# EAGLE design v12 (EAGLE 9.3.0)

## Sheet 1 of 3
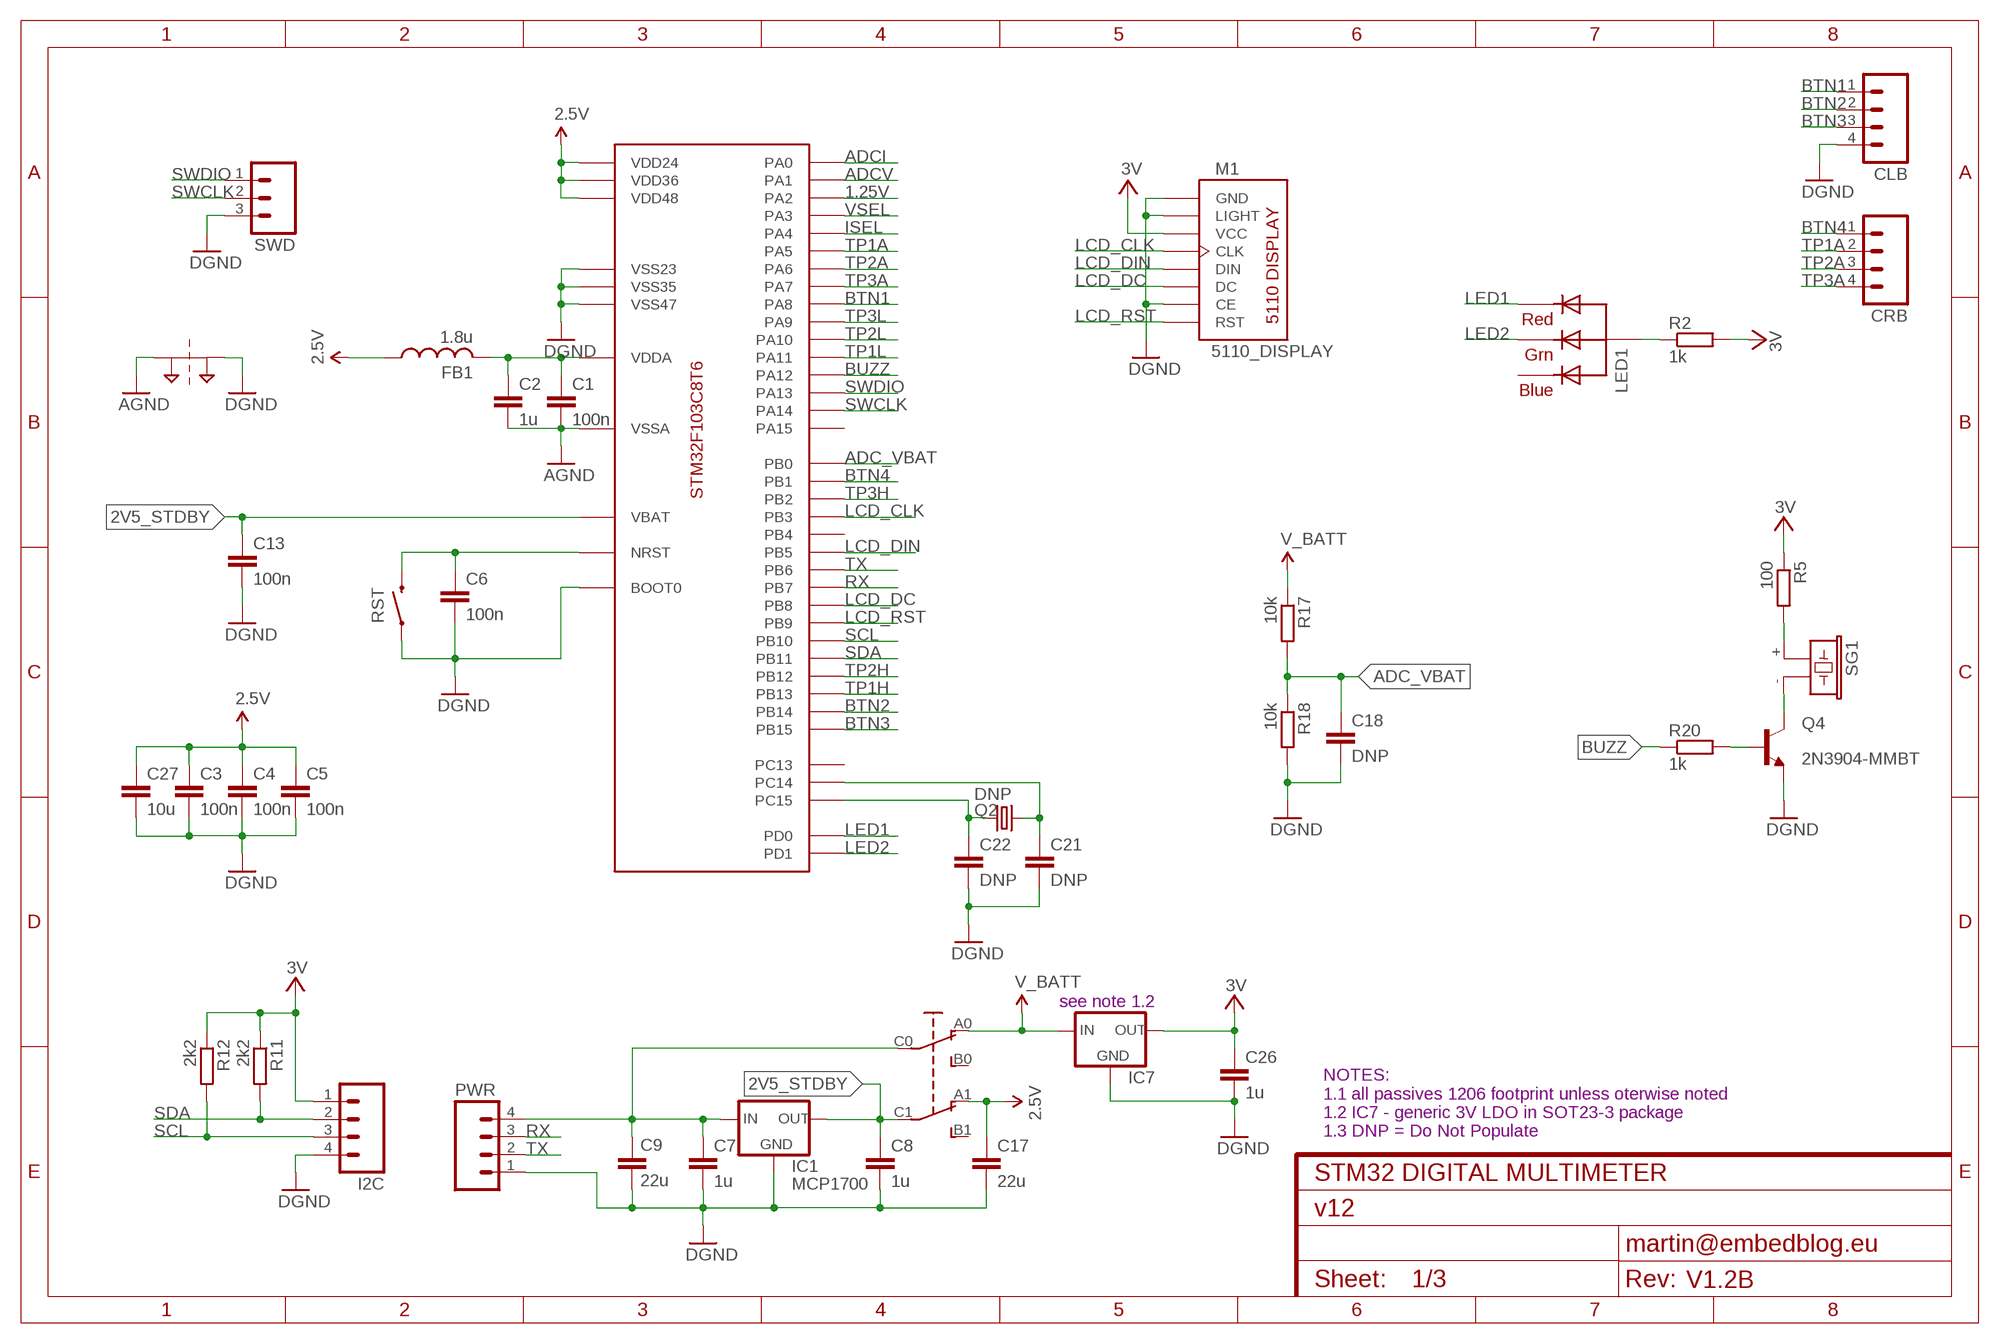
[diagram p0: schematic, sheet 1]
FRAME2 (FRAME-A4L): CNAME: STM32 DIGITAL MULTIMETER; CREVISION: V1.2B; DESIGNER: martin@embedblog.eu

### Parts
C1  100n  C-EUC1206  [C1206]
C2  1u  C-EUC1206  [C1206]
C3  100n  C-EUC1206  [C1206]
C4  100n  C-EUC1206  [C1206]
C5  100n  C-EUC1206  [C1206]
C6  100n  C-EUC1206  [C1206]
C7  1u  C-EUC1206  [C1206]
C8  1u  C-EUC1206  [C1206]
C9  22u  C-EUC1206  [C1206]
C13  100n  C-EUC1206  [C1206]
C17  22u  C-EUC1206  [C1206]
C18  DNP  C-EUC1206  [C1206]
C21  DNP  C-EUC1206  [C1206]
C22  DNP  C-EUC1206  [C1206]
C26  1u  C-EUC1206  [C1206]
C27  10u  C-EUC1206  [C1206]
CLB  M04PTH  [1X04@1]
CRB  M04PTH  [1X04@1]
FB1  1.8u  FERRITE-BEADC  [1206]
I2C  M04PTH  [1X04@1]
IC1  MCP1700  XC63FPM  [SOT23]
IC7  XC63FPM  [SOT23]
LED1  RGBLED_CA-5MM  [LED5MMRGB]
M1  5110_DISPLAY  [5110_LAYOUT]
PWR  M04PTH  [1X04@1]
Q2  DNP  CRYSTALTC26H  [TC26H]
Q4  2N3904-MMBT  [SOT23]
R2  1k  R-EU_R1206  [R1206]
R5  100  R-EU_R1206  [R1206]
R11  2k2  R-EU_R1206  [R1206]
R12  2k2  R-EU_R1206  [R1206]
R17  10k  R-EU_R1206  [R1206]
R18  10k  R-EU_R1206  [R1206]
R20  1k  R-EU_R1206  [R1206]
RST  SWITCH-MOMENTARY-2SMD  [TACTILE-SWITCH-SMD]
SG1  F/CM12P  [F/CM12P]
SJ1  2PT_GND_TIE  [2PT_GND_TIE]
SWD  M03PTH  [1X03]
U$1  STM32F103C8T6  [TQFP-48]
U$16  K3-2245_DPDT_SIDE_SWITCH  [K3-2245_DPDT_SWITCH]

### Nets
1.25V: U$1.12(PA2) ; also sheet 2
2.5V: C3.1 C4.1 C5.1 C17.1 C27.1 FB1.1 U$1.24(VDD24) U$1.36(VDD36) U$1.48(VDD48) U$16.A1(O1) ; also sheet 2
2V5_STDBY: C8.1 C13.1 IC1.2(OUT) U$1.1(VBAT) U$16.C1(P1)
3V: C26.1 I2C.1 IC7.2(OUT) M1.VCC R2.2 R5.1 R11.1 R12.1 ; also sheet 2
ADC_VBAT: C18.1 R17.2 R18.1 U$1.18(PB0)
ADCI: U$1.10(PA0) ; also sheet 2
ADCV: U$1.11(PA1) ; also sheet 2
AGND: C1.2 C2.2 SJ1.P$1 U$1.8(VSSA) ; also sheet 2
BTN1: CLB.1 U$1.29(PA8)
BTN2: CLB.2 U$1.27(PB14)
BTN3: CLB.3 U$1.28(PB15)
BTN4: CRB.1 U$1.19(PB1)
BUZZ: R20.1 U$1.33(PA12)
GND: C3.2 C4.2 C5.2 C6.2 C7.2 C8.2 C9.2 C13.2 C17.2 C18.2 C21.2 C22.2 C26.2 C27.2 CLB.4 I2C.4 IC1.1(GND) IC7.1(GND) M1.CE M1.GND M1.LIGHT PWR.1 Q4.2(E) R18.2 RST.1 SJ1.P$2 SWD.3 U$1.23(VSS23) U$1.35(VSS35) U$1.44(BOOT0) U$1.47(VSS47) ; supply symbol labelled DGND ; also sheet 2
ISEL: U$1.14(PA4) ; also sheet 2
LCD_CLK: M1.CLK U$1.39(PB3)
LCD_DC: M1.DC U$1.45(PB8)
LCD_DIN: M1.DIN U$1.41(PB5)
LCD_RST: M1.RST U$1.46(PB9)
LED1: LED1.1(RED) U$1.5(PD0)
LED2: LED1.3(GREEN) U$1.6(PD1)
N$1: C6.1 RST.3 U$1.7(NRST)
N$2: C22.1 Q2.1 U$1.4(PC15)
N$8: C1.1 C2.1 FB1.2 U$1.9(VDDA)
N$16: R5.2 SG1.+
N$21: C21.1 Q2.2 U$1.3(PC14)
N$24: LED1.2(VCC) R2.1
N$36: Q4.3(C) SG1.-
N$37: Q4.1(B) R20.2
N$38: C7.1 C9.1 IC1.3(IN) PWR.4 U$16.C0(P)
RX: PWR.3 U$1.43(PB7)
SCL: I2C.3 R12.2 U$1.21(PB10)
SDA: I2C.2 R11.2 U$1.22(PB11)
SWCLK: SWD.2 U$1.37(PA14)
SWDIO: SWD.1 U$1.34(PA13)
TP1A: CRB.2 U$1.15(PA5) ; also sheet 2
TP1H: U$1.26(PB13) ; also sheet 2
TP1L: U$1.32(PA11) ; also sheet 2
TP2A: CRB.3 U$1.16(PA6) ; also sheet 2
TP2H: U$1.25(PB12) ; also sheet 2
TP2L: U$1.31(PA10) ; also sheet 2
TP3A: CRB.4 U$1.17(PA7) ; also sheet 2
TP3H: U$1.20(PB2) ; also sheet 2
TP3L: U$1.30(PA9) ; also sheet 2
TX: PWR.2 U$1.42(PB6)
V_BATT: IC7.3(IN) R17.1 U$16.A0(O) ; also sheet 3
VSEL: U$1.13(PA3) ; also sheet 2
Unconnected: LED1.4(BLUE) U$1.2(PC13) U$1.38(PA15) U$1.40(PB4) U$16.B0(S) U$16.B1(S1)

### Notes on the sheet
- see note 1.2
- NOTES:
  1.1 all passives 1206 footprint unless oterwise noted
  1.2 IC7 - generic 3V LDO in SOT23-3 package
  1.3 DNP = Do Not Populate

## Sheet 2 of 3
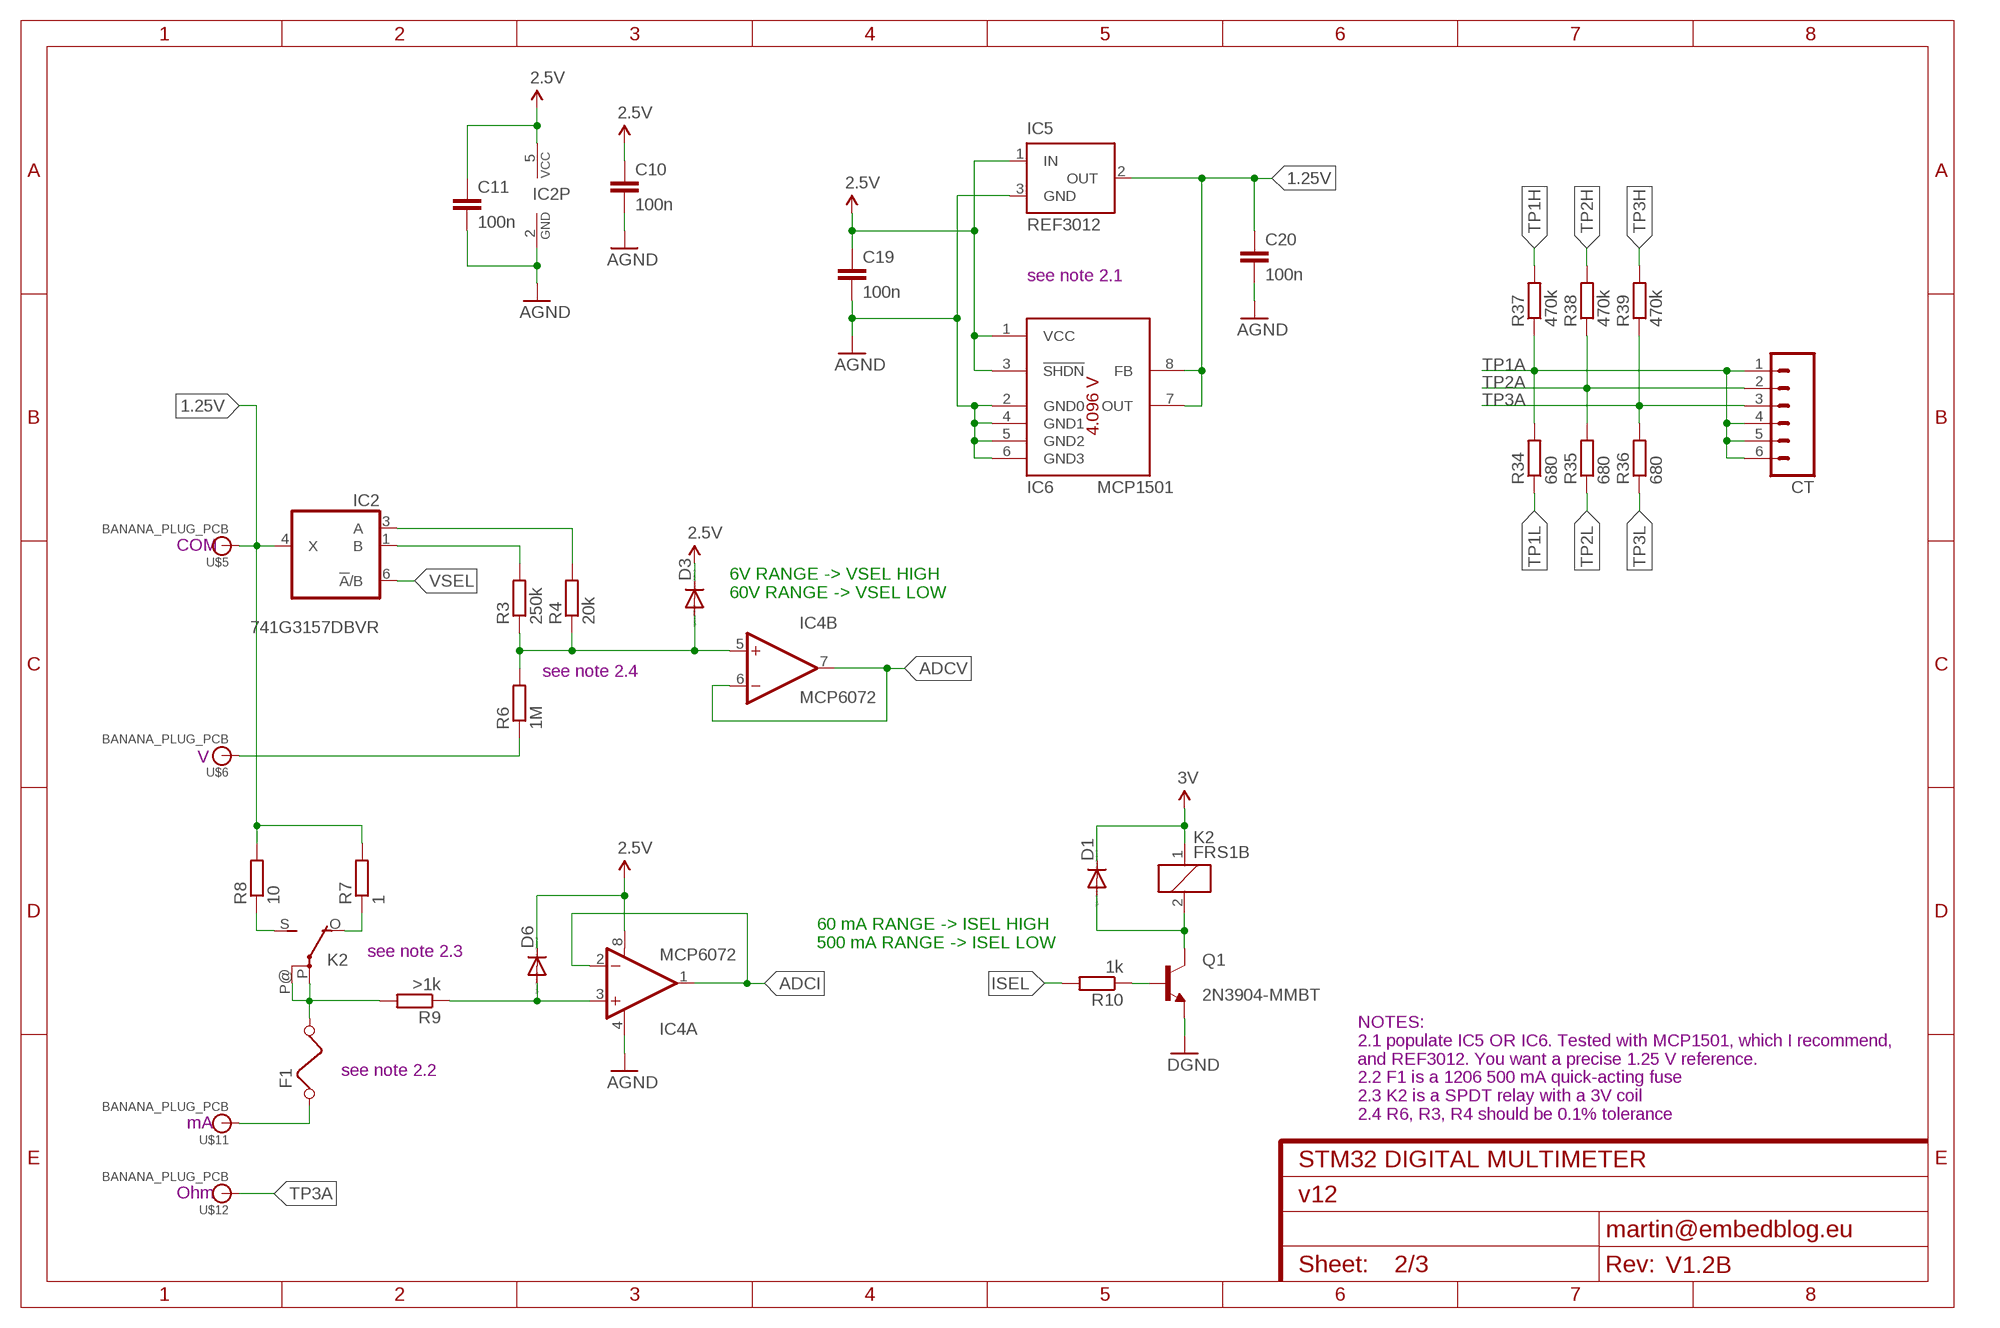
[diagram p1: schematic, sheet 2]
FRAME1 (FRAME-A4L): CNAME: STM32 DIGITAL MULTIMETER; CREVISION: V1.2B; DESIGNER: martin@embedblog.eu

### Parts
C10  100n  CAP1206  [1206]
C11  100n  CAP1206  [1206]
C19  100n  C-EUC1206  [C1206]
C20  100n  C-EUC1206  [C1206]
CT  M06SILK_FEMALE_PTH  [1X06]
D1  DIODE-MINIMELF  [MINIMELF]
D3  DIODE-MINIMELF  [MINIMELF]
D6  DIODE-MINIMELF  [MINIMELF]
F1  FUSEC  [1206]
IC2  741G3157DBVR  [DBV_R-PDSO-G6]
IC4  MCP6072  OPAMP-DUALU  [SO08]
IC5  REF3012  MAX6520  [SOT23]
IC6  MCP1501  [SO08]
K2  FRS1B  [FRS1B]
Q1  2N3904-MMBT  [SOT23]
R3  250k  R-EU_R1206  [R1206]
R4  20k  R-EU_R1206  [R1206]
R6  1M  R-EU_R1206  [R1206]
R7  1  R-EU_R1206  [R1206]
R8  10  R-EU_R1206  [R1206]
R9  >1k  R-EU_R1206  [R1206]
R10  1k  R-EU_R1206  [R1206]
R34  680  R-EU_R1206  [R1206]
R35  680  R-EU_R1206  [R1206]
R36  680  R-EU_R1206  [R1206]
R37  470k  R-EU_R1206  [R1206]
R38  470k  R-EU_R1206  [R1206]
R39  470k  R-EU_R1206  [R1206]
U$5  BANANA_PLUG_PCB  [BANANA_6MMHOLE]
U$6  BANANA_PLUG_PCB  [BANANA_6MMHOLE]
U$11  BANANA_PLUG_PCB  [BANANA_6MMHOLE]
U$12  BANANA_PLUG_PCB  [BANANA_6MMHOLE]

### Nets
1.25V: C20.1 IC2.4(X) IC5.2(OUT) IC6.7(OUT) IC6.8(FB) R7.2 R8.2 U$5.P$1 ; also sheet 1
2.5V: C10.1 C11.1 C19.1 D3.C D6.C IC2.5(VCC) IC4.8(A:V+) IC5.1(IN) IC6.1(VCC) IC6.3(!SHDN) ; also sheet 1
3V: D1.C K2.1 ; also sheet 1
ADCI: IC4.1(A:OUT) IC4.2(A:-IN) ; also sheet 1
ADCV: IC4.6(B:-IN) IC4.7(B:OUT) ; also sheet 1
AGND: C10.2 C11.2 C19.2 C20.2 IC2.2(GND) IC4.4(A:V-) IC5.3(GND) IC6.2(GND0) IC6.4(GND1) IC6.5(GND2) IC6.6(GND3) ; also sheet 1
GND: Q1.2(E) ; supply symbol labelled DGND ; also sheet 1
ISEL: R10.2 ; also sheet 1
N$3: IC2.1(B) R3.2
N$4: IC2.3(A) R4.2
N$5: D3.A IC4.5(B:+IN) R3.1 R4.1 R6.2
N$6: Q1.1(B) R10.1
N$7: F1.2 K2.P(2:P) K2.P@(2:P) R9.2
N$9: R6.1 U$6.P$1
N$10: K2.S(2:S) R8.1
N$11: D1.A K2.2 Q1.3(C)
N$12: K2.O(2:O) R7.1
N$18: D6.A IC4.3(A:+IN) R9.1
N$22: F1.1 U$11.P$1
TP1A: CT.1 CT.4 CT.5 CT.6 R34.2 R37.1 ; also sheet 1
TP1H: R37.2 ; also sheet 1
TP1L: R34.1 ; also sheet 1
TP2A: CT.2 R35.2 R38.1 ; also sheet 1
TP2H: R38.2 ; also sheet 1
TP2L: R35.1 ; also sheet 1
TP3A: CT.3 R36.2 R39.1 U$12.P$1 ; also sheet 1
TP3H: R39.2 ; also sheet 1
TP3L: R36.1 ; also sheet 1
VSEL: IC2.6(!A!/B) ; also sheet 1

### Notes on the sheet
- see note 2.1
- COM
- 6V RANGE -> VSEL HIGH
  60V RANGE -> VSEL LOW
- see note 2.4
- V
- 60 mA RANGE -> ISEL HIGH
  500 mA RANGE -> ISEL LOW
- see note 2.3
- see note 2.2
- NOTES:
  2.1 populate IC5 OR IC6. Tested with MCP1501, which I recommend, 
  and REF3012. You want a precise 1.25 V reference.
  2.2 F1 is a 1206 500 mA quick-acting fuse
  2.3 K2 is a SPDT relay with a 3V coil
  2.4 R6, R3, R4 should be 0.1% tolerance
- mA
- Ohm

## Sheet 3 of 3
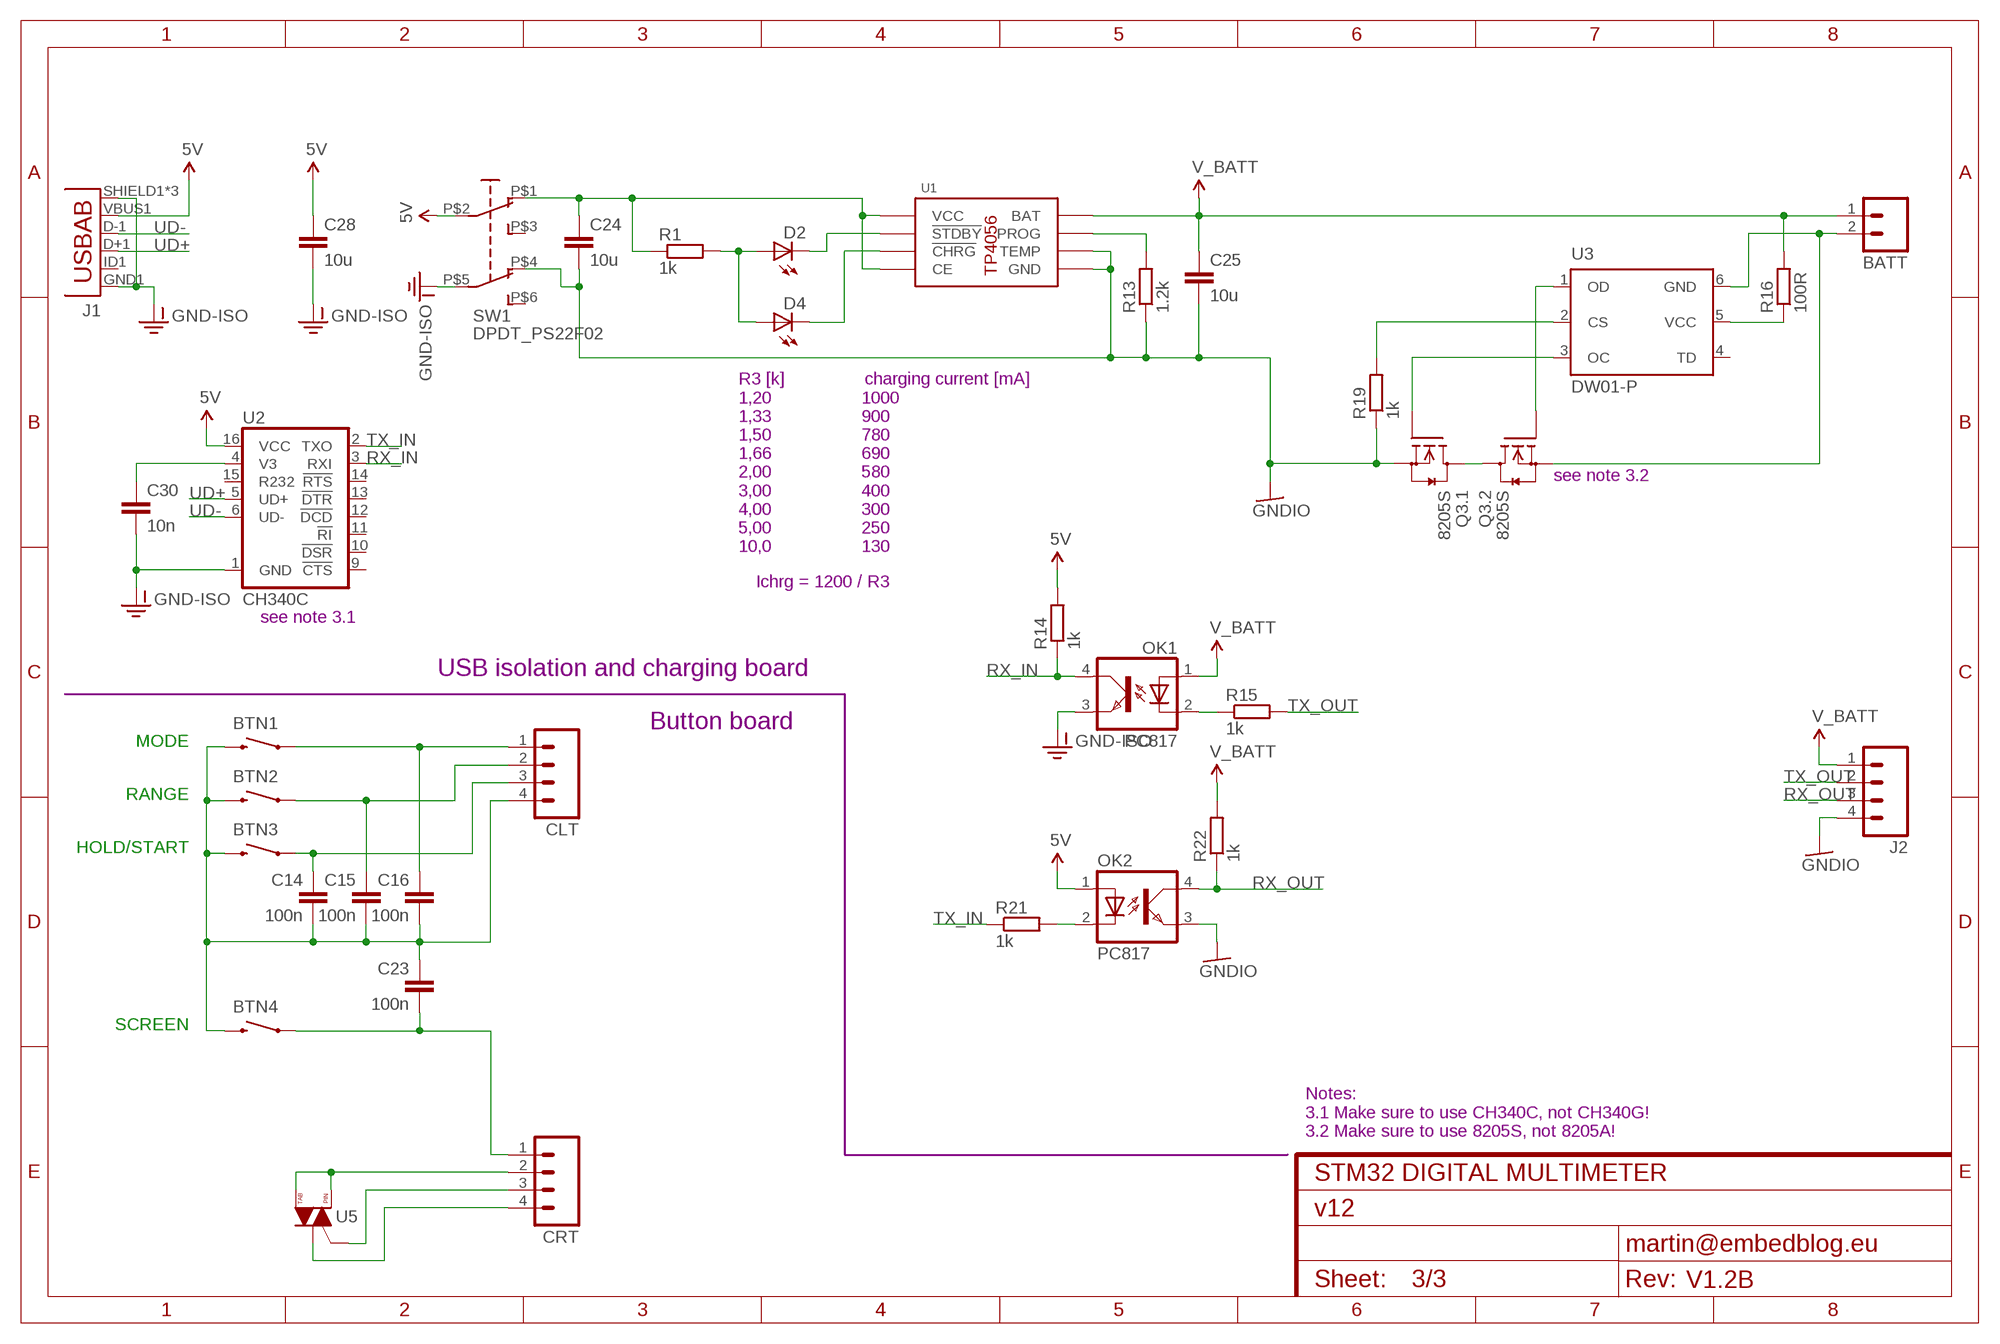
[diagram p2: schematic, sheet 3]
FRAME3 (FRAME-A4L): CNAME: STM32 DIGITAL MULTIMETER; CREVISION: V1.2B; DESIGNER: martin@embedblog.eu

### Parts
BATT  M02PTH3  [1X02_LONGPADS]
BTN1  SWITCH-MOMENTARY-2PTH  [TACTILE-PTH]
BTN2  SWITCH-MOMENTARY-2PTH  [TACTILE-PTH]
BTN3  SWITCH-MOMENTARY-2PTH  [TACTILE-PTH]
BTN4  SWITCH-MOMENTARY-2PTH  [TACTILE-PTH]
C14  100n  C-EUC1206  [C1206]
C15  100n  C-EUC1206  [C1206]
C16  100n  C-EUC1206  [C1206]
C23  100n  C-EUC1206  [C1206]
C24  10u  C-EUC1206  [C1206]
C25  10u  C-EUC1206  [C1206]
C28  10u  C-EUC1206  [C1206]
C30  10n  C-EUC1206  [C1206]
CLT  M04PTH  [1X04@1]
CRT  M04PTH  [1X04@1]
D2  LEDCHIPLED_1206  [CHIPLED_1206]
D4  LEDCHIPLED_1206  [CHIPLED_1206]
J1  USB-ABCONN-11794  [USB-AB-MICRO-SMD_V03]
J2  M04PTH  [1X04@1]
OK1  PC817  [DIL04]
OK2  PC817  [DIL04]
Q3  8205S  FDC6305N  [SSOT-6]
R1  1k  R-EU_R1206  [R1206]
R13  1.2k  R-EU_R1206  [R1206]
R14  1k  R-EU_R1206  [R1206]
R15  1k  R-EU_R1206  [R1206]
R16  100R  R-EU_R1206  [R1206]
R19  1k  R-EU_R1206  [R1206]
R21  1k  R-EU_R1206  [R1206]
R22  1k  R-EU_R1206  [R1206]
SW1  DPDT_PS22F02  [PS22_L02_DPDT_SW]
U1  TP4056  [SOP8]
U2  CH340C  [SO016]
U3  DW01-P  [SOT23-6L]
U5  TRIAC-HPSMD  [SOT223]

### Nets
5V: C28.1 J1.VBUS1(VBUS) OK2.1(A) R14.2 SW1.P$2(P) U2.16(VCC)
5V_ISO: C24.1 R1.1 SW1.P$1(O) U1.4(VCC) U1.8(CE)
BTN1T: BTN1.1 C16.1 CLT.1
BTN2T: BTN2.1 C15.1 CLT.2
BTN3T: BTN3.1 C14.1 CLT.3
GND-ISO: C28.2 C30.2 J1.GND1(GND) J1.SHIELD1(SHIELD) J1.SHIELD2(SHIELD) J1.SHIELD3(SHIELD) OK1.3(EMIT) SW1.P$5(P1) U2.1(GND)
GNDIO: C24.2 C25.2 J2.4 OK2.3(EMIT) Q3.5(.1:S) R13.1 R19.1 SW1.P$4(O1) U1.1(TEMP) U1.3(GND)
N$13: D2.A D4.A R1.2
N$14: BTN1.3 BTN2.3 BTN3.3 BTN4.3 C14.2 C15.2 C16.2 C23.1 CLT.4
N$15: CRT.2 U5.2(T2) U5.4(T2)
N$17: BTN4.1 C23.2 CRT.1
N$19: CRT.3 U5.3(G)
N$20: CRT.4 U5.1(T1)
N$23: D2.C U1.6(!STDBY)
N$25: D4.C U1.7(!CHRG)
N$26: R13.2 U1.2(PROG)
N$27: C30.1 U2.4(V3)
N$28: OK2.2(C) R21.2
N$29: OK1.2(C) R15.1
N$30: R16.1 U3.5(VCC)
N$31: BATT.2 Q3.2(.2:S) U3.6(GND)
N$32: Q3.4(.2:D) Q3.6(.1:D)
N$33: Q3.3(.2:G) U3.1(OD)
N$34: Q3.1(.1:G) U3.3(OC)
N$35: R19.2 U3.2(CS)
RX_IN: OK1.4(COL) R14.1 U2.3(RXI)
RX_OUT: J2.3 OK2.4(COL) R22.1
TX_IN: R21.1 U2.2(TXO)
TX_OUT: J2.2 R15.2
UD+: J1.D+1(D+) U2.5(UD+)
UD-: J1.D-1(D-) U2.6(UD-)
V_BATT: BATT.1 C25.1 J2.1 OK1.1(A) R16.2 R22.2 U1.5(BAT) ; also sheet 1
Unconnected: J1.ID1(USBID) SW1.P$3(S) SW1.P$6(S1) U2.9(!CTS) U2.10(!DSR) U2.11(!RI) U2.12(!DCD) U2.13(!DTR) U2.14(!RTS) U2.15(R232) U3.4(TD)

### Notes on the sheet
- see note 3.2
- R3 [k]                charging current [mA]
  1,20                  1000
  1,33                  900
  1,50                  780
  1,66                  690
  2,00                  580
  3,00                  400
  4,00                  300
  5,00                  250
  10,0                  130
- Ichrg = 1200 / R3
- see note 3.1
- USB isolation and charging board
- Button board
- MODE
- RANGE
- HOLD/START
- SCREEN
- Notes:
  3.1 Make sure to use CH340C, not CH340G!
  3.2 Make sure to use 8205S, not 8205A!

## Library data of the parts
BATT = SparkFun-Connectors:M02: Standard 2-pin 0.1" header. Use with - straight break away headers ( PRT-00116) - right angle break away headers (PRT-00553) - swiss pins (PRT-00743) - machine pins (PRT-00117) - female headers (PRT-00115) Molex polarized connector foot print use with: PRT-08233 with associated crimp pins and housings. 2.54_SCREWTERM for use with PRT-10571. 3.5mm Screw Terminal footprints for PRT-08084 5mm Screw Terminal footprints for use with PRT-08432
BTN1-BTN4 = SparkFun-Electromechanical:SWITCH-MOMENTARY-2: Various NO switches- pushbuttons, reed, etc; PROD_ID: SWCH-08441
C1-C9 C13-C28 C30 = resistor:C-EU: CAPACITOR, European symbol
C10 C11 = SparkFun-Passives:CAP: Capacitor Standard 0603 ceramic capacitor, and 0.1" leaded capacitor.
CLB CLT CRB CRT I2C J2 PWR = SparkFun-Connectors:M04: Header 4 Standard 4-pin 0.1" header. Use with straight break away headers (SKU : PRT-00116), right angle break away headers (PRT-00553), swiss pins (PRT-00743), machine pins (PRT-00117), and female headers (PRT-00115). Molex polarized connector foot print use with SKU : PRT-08231 with associated crimp pins and housings. 1MM SMD Version SKU: PRT-10208; PROD_ID: CONN-09696
CT = SparkFun-Connectors:M06: Header 6 Standard 6-pin 0.1" header. Use with straight break away headers (SKU : PRT-00116), right angle break away headers (PRT-00553), swiss pins (PRT-00743), machine pins (PRT-00117), and female headers (PRT-00115). Molex polarized connector foot print use with SKU : PRT-08094 with associated crimp pins and housings. NOTES ON THE VARIANTS LOCK and LOCK_LONGPADS... This footprint was designed to help hold the alignment of a through-hole component (i.e. 6-pin header) while soldering it into place. You may notice that each hole has been shifted either up or down by 0.005 of an inch from it's more standard position (which is a perfectly straight line). This slight alteration caused the pins (the squares in the middle) to touch the edges of the holes. Because they are alternating, it causes a "brace" to hold the component in place. 0.005 has proven to be the perfect amount of "off-center" position when using our standard breakaway headers. Although looks a little odd when you look at the bare footprint, once you have a header in there, the alteration is very hard to notice. Also,if you push a header all the way into place, it is covered up entirely on the bottom side. This idea of altering the position of holes to aid alignment will be further integrated into the Sparkfun Library for other footprints. It can help hold any component with 3 or more connection pins.; PROD_ID: CONN-08437
D1 D3 D6 = diode:DIODE-: DIODE
D2 D4 = led:LED: LED OSRAM: - CHIPLED LG R971, LG N971, LY N971, LG Q971, LY Q971, LO R971, LY R971 LH N974, LH R974 LS Q976, LO Q976, LY Q976 LO Q996 - Hyper CHIPLED LW Q18S LB Q993, LB Q99A, LB R99A - SideLED LS A670, LO A670, LY A670, LG A670, LP A670 LB A673, LV A673, LT A673, LW A673 LH A674 LY A675 LS A676, LA A676, LO A676, LY A676, LW A676 LS A679, LY A679, LG A679 - Hyper Micro SIDELED® LS Y876, LA Y876, LO Y876, LY Y876 LT Y87S - SmartLED LW L88C, LW L88S LB L89C, LB L89S, LG L890 LS L89K, LO L89K, LY L89K LS L896, LA L896, LO L896, LY L896 - TOPLED LS T670, LO T670, LY T670, LG T670, LP T670 LSG T670, LSP T670, LSY T670, LOP T670, LYG T670 LG T671, LOG T671, LSG T671 LB T673, LV T673, LT T673, LW T673 LH T674 LS T676, LA T676, LO T676, LY T676, LB T676, LH T676, LSB T676, LW T676 LB T67C, LV T67C, LT T67C, LS T67K, LO T67K, LY T67K, LW E67C LS E67B, LA E67B, LO E67B, LY E67B, LB E67C, LV E67C, LT E67C LW T67C LS T679, LY T679, LG T679 LS T770, LO T770, LY T770, LG T770, LP T770 LB T773, LV T773, LT T773, LW T773 LH T774 LS E675, LA E675, LY E675, LS T675 LS T776, LA T776, LO T776, LY T776, LB T776 LHGB T686 LT T68C, LB T68C - Hyper Mini TOPLED® LB M676 - Mini TOPLED Santana® LG M470 LS M47K, LO M47K, LY M47K Source: http://www.osram.convergy.de LUXEON: - LUMILED® LXK2-PW12-R00, LXK2-PW12-S00, LXK2-PW14-U00, LXK2-PW14-V00 LXK2-PM12-R00, LXK2-PM12-S00, LXK2-PM14-U00 LXK2-PE12-Q00, LXK2-PE12-R00, LXK2-PE12-S00, LXK2-PE14-T00, LXK2-PE14-U00 LXK2-PB12-K00, LXK2-PB12-L00, LXK2-PB12-M00, LXK2-PB14-N00, LXK2-PB14-P00, LXK2-PB14-Q00 LXK2-PR12-L00, LXK2-PR12-M00, LXK2-PR14-Q00, LXK2-PR14-R00 LXK2-PD12-Q00, LXK2-PD12-R00, LXK2-PD12-S00 LXK2-PH12-R00, LXK2-PH12-S00 LXK2-PL12-P00, LXK2-PL12-Q00, LXK2-PL12-R00 Source: www.luxeon.com KINGBRIGHT: KA-3528ASYC Source: www.kingbright.com
F1 = m-pad-2.1:FUSE: Fuse's in various packages
FB1 = m-pad-2.1:FERRITE-BEAD: Ferrite beads in various packages
IC1 IC7 = v-reg:XC63FP: Positiv Voltage Regulators www.torex.co.jp/english/product/pro02/pdf/0201_xc62fp.pdf
IC2 = 74xx-little-de:74*1G3157: Single-Pole, Double-Throw Analog Switch Source: http://focus.ti.com/lit/ds/symlink/sn74lvc1g3157.pdf
IC4 = SparkFun-AnalogIC:OPAMP-DUAL: Generic op-amp footprint
IC5 = maxim:MAX6520: 1.2V Voltage Reference 50ppm/°C, SOT23, 3-Terminal Source: Data sheet <http://datasheets.maxim-ic.com/en/ds/MAX6520.pdf>; MF: MAXIM; MPN: MAX6520EUR-T; OC_FARNELL: unknown; OC_NEWARK: 02J4586
IC6 = custom:MCP1501
J1 = SparkFun-Connectors:USB-AB: This is a USB AB connector that is compatible with USB OTG. i.e. this connector can serve as a host or device; PROD_ID: CONN-11794
K2 = relay:FRS1B: RELAY 1 x switch, same as V23101-D6-A201, Siemens; OC_FARNELL: unknown; OC_NEWARK: unknown
LED1 = adafruit:RGBLED_CA: RGB LED, common-anode 5MM Staggered pins 5mm Piranha package http://www.ladyada.net/library/pcb/eaglelibrary.html
M1 = custom:5110_DISPLAY
OK1 OK2 = optocoupler:PC817: SHARP OPTO COUPLER; MPN: PC817X4J000F; OC_FARNELL: 9707727; OC_NEWARK: 97K7059
Q1 Q4 = m-pad-2.1:2N3904: NPN TRANSISTOR
Q2 = crystal:CRYSTAL: CRYSTAL; OC_FARNELL: unknown; OC_NEWARK: unknown
Q3 = m-pad-2.1:FDC6305N: Fairchild's FDC6305N Dual N-Channel 2.5V Specified PowerTrenchTM MOSFET General Description: These N-Channel low threshold 2.5V specified MOSFETs are produced using Fairchild Semiconductor's advanced PowerTrench process that has been especially tailored to minimize on-state resistance and yet maintain low gate charge for superior switching performance. Features: 2.7 A, 20 V. RDS(ON) = 0.08Ohm @ VGS = 4.5 V RDS(ON) = 0.12Ohm @ VGS = 2.5 V Low gate charge (3.5nC typical). Fast switching speed. High performance trench technology for extremely low RDS(ON). SuperSOTTM-6 package: small footprint (72% smaller than standard SO-8); low profile (1mm thick). Applications: Load switch DC/DC converter Motor driving Please send any comments to: messi@users.sourceforge.net
R1-R22 R34-R39 = resistor:R-EU_: RESISTOR, European symbol
RST = SparkFun-Electromechanical:SWITCH-MOMENTARY-2: Various NO switches- pushbuttons, reed, etc; PROD_ID: SWCH-08247
SG1 = buzzer:F/CM12P: BUZZER Source: Buerklin; OC_FARNELL: unknown; OC_NEWARK: unknown
SJ1 = SparkFun-Passives:2PT_GND_TIE: Package for connecting two ground nets in one place.
SW1 = custom:DPDT_PS22F02
SWD = SparkFun-Connectors:M03: Header 3 Standard 3-pin 0.1" header. Use with straight break away headers (SKU : PRT-00116), right angle break away headers (PRT-00553), swiss pins (PRT-00743), machine pins (PRT-00117), and female headers (PRT-00115). Molex polarized connector foot print use with SKU : PRT-08232 with associated crimp pins and housings.
U1 = custom:TP4056
U2 = SparkFun-IC-Comms:CH340C; PROD_ID: IC-14038
U3 = lipo:DW01-P: One Cell Lithium-ion/Polymer Battery Protection IC The DW01-P battery protection IC is designed to protect lithium-ion/polymer battery from damage or degrading the lifetime due to overcharge, overdischarge, and/or overcurrent for one-cell lithium-ion/polymer battery powered systems, such as cellular phones. The ultra-small package and less required external components make it ideal to integrate the DW01-P into the limited space of battery pack. The accurate ±50mV overcharging detection voltage ensures safe and full utilization charging. The very low standby current drains little current from the cell while in storage.
U5 = SparkFun-DiscreteSemi:TRIAC-HP: TRIAC High Power Used for EL wire applications; PROD_ID: VREG-09120
U$1 = SparkFun-DigitalIC:STM32F103C8T6
U$5 U$6 U$11 U$12 = custom:BANANA_PLUG_PCB
U$16 = custom:K3-2245_DPDT_SIDE_SWITCH

## Board
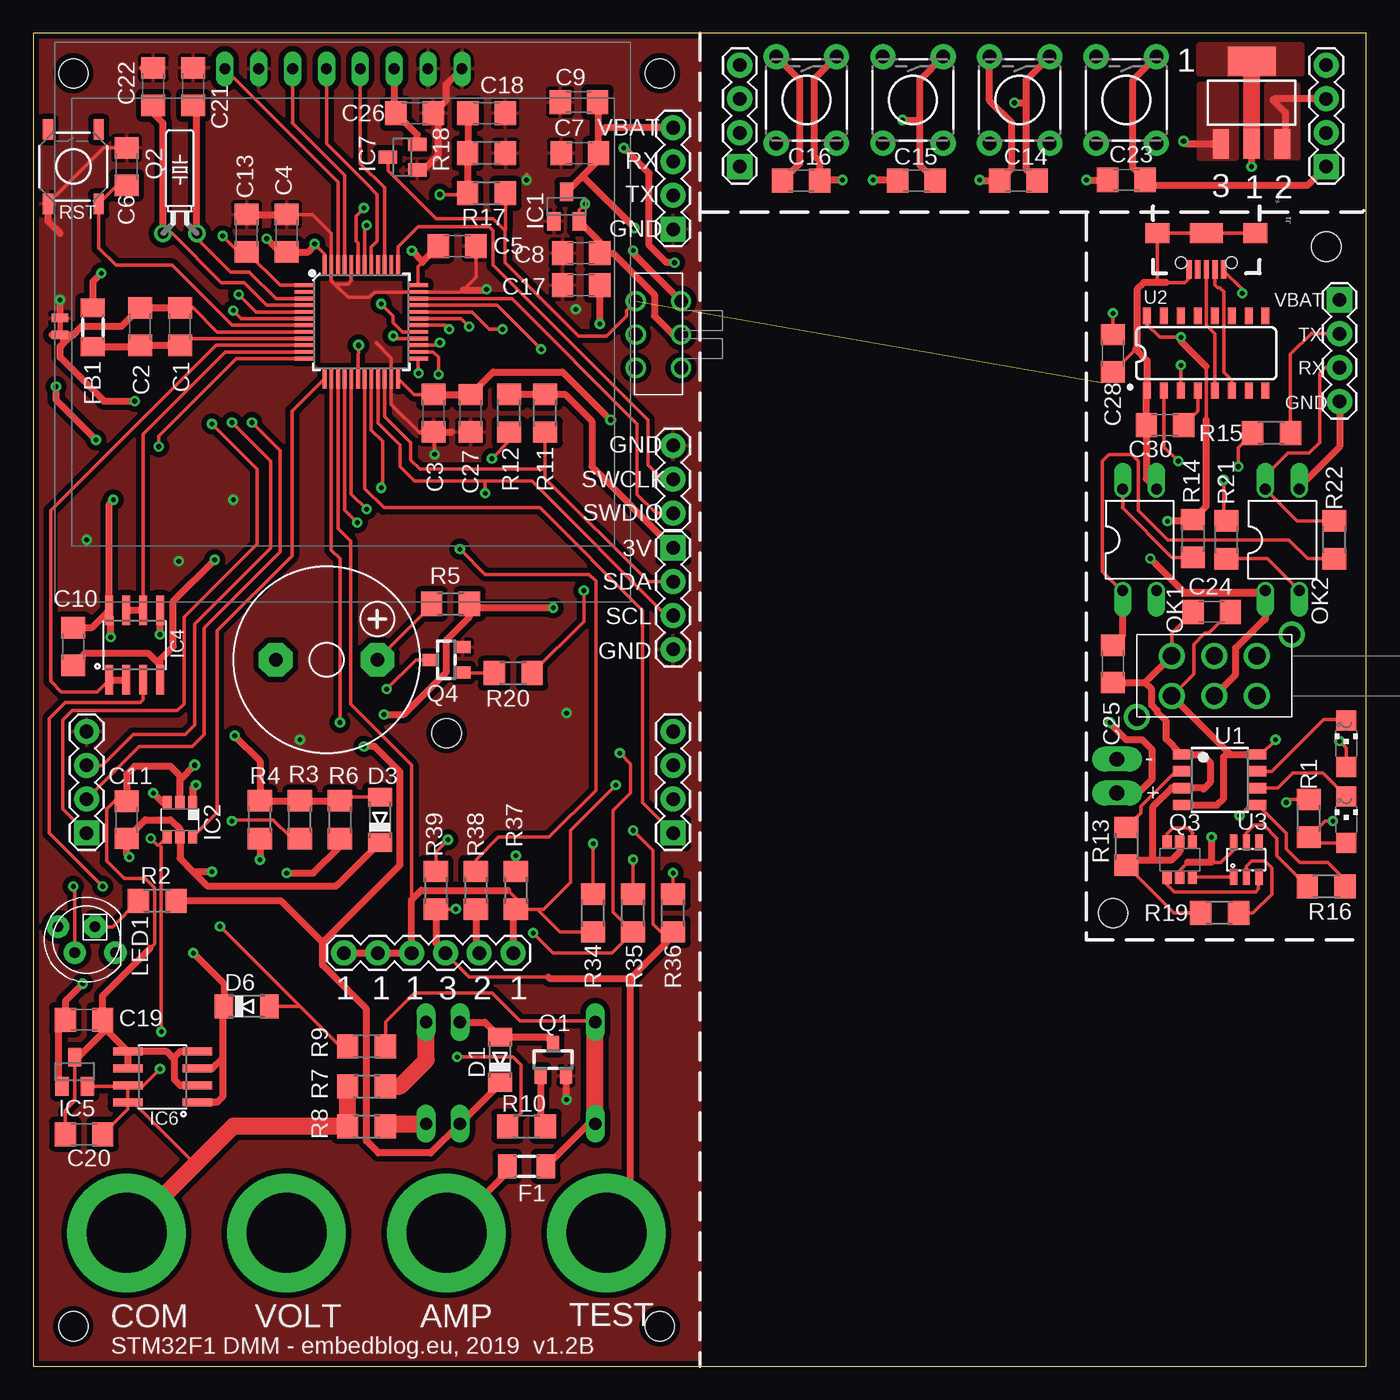
[diagram p3: board, top side]
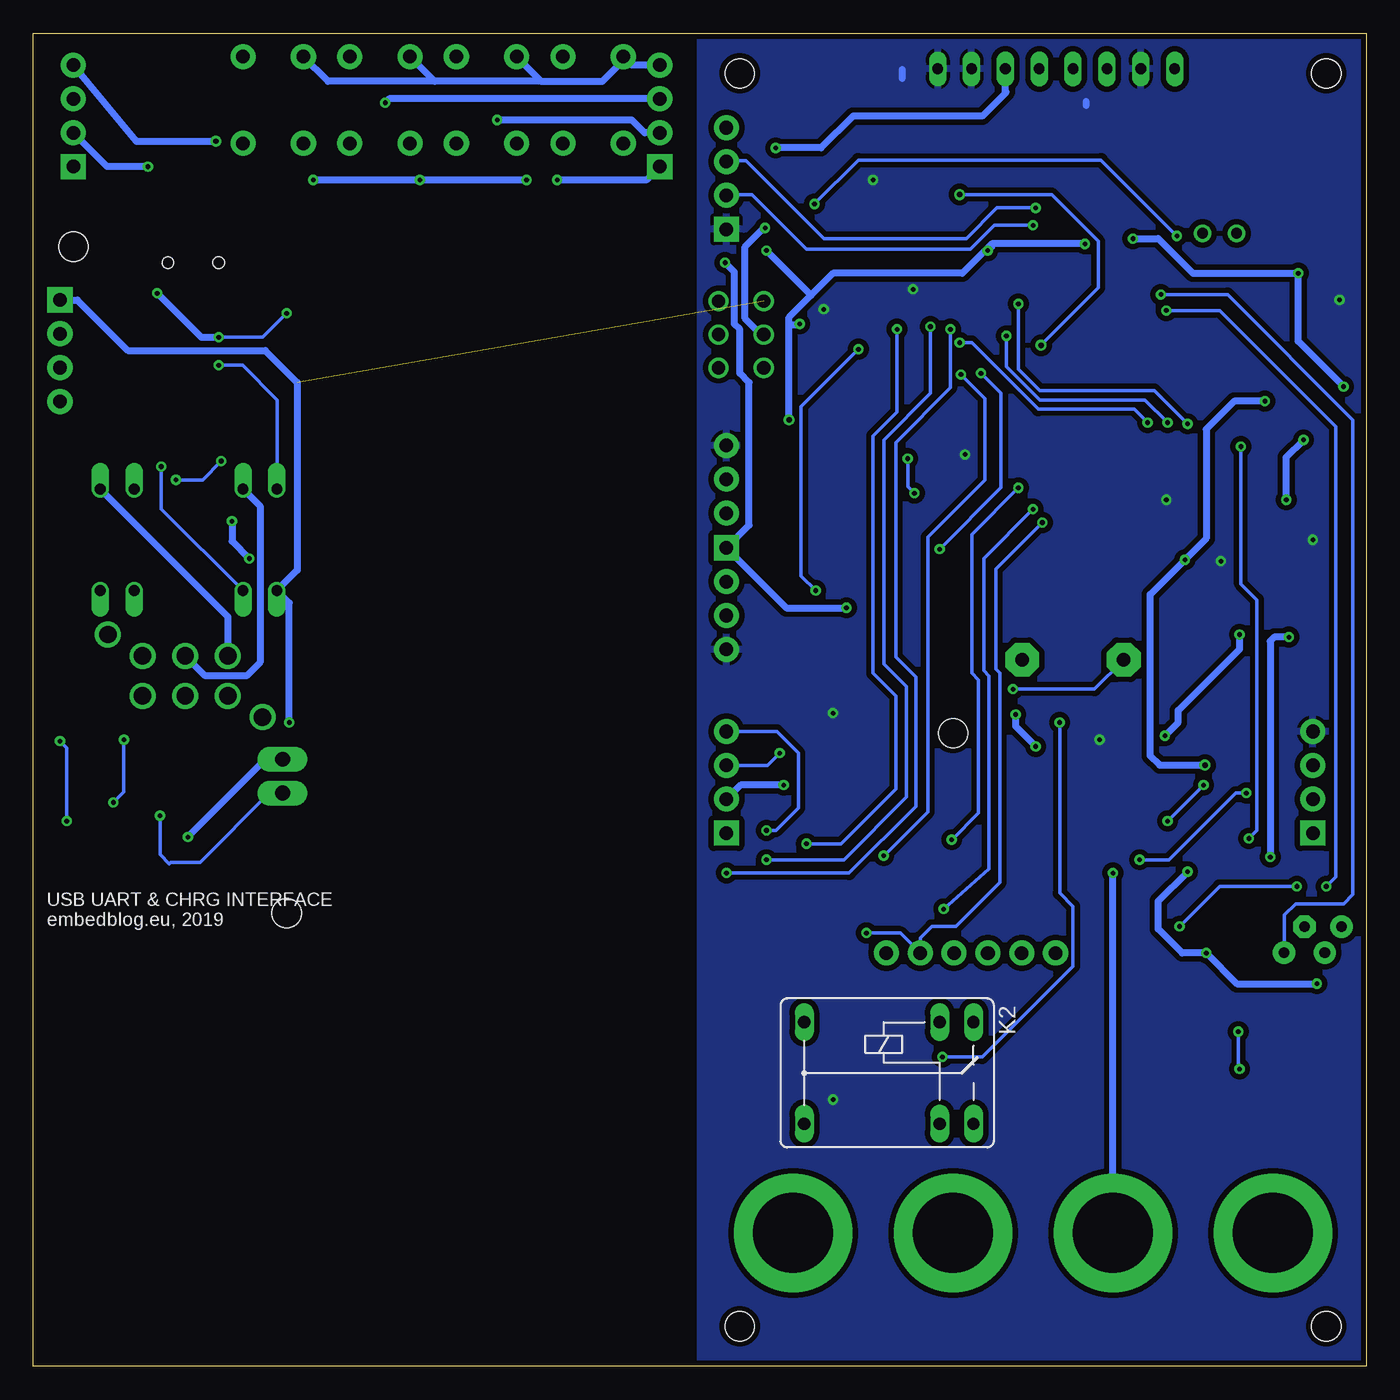
[diagram p4: board, bottom side, seen from below]

Size 100 x 100 mm. Coordinates in mm from the lower left corner, seen from the top.
Outline: 0,0 100,0 100,100 0,100 0,0
Copper layers (1*16): Top 0.035mm / dielectric 1.5mm / Bottom 0.035mm
Design rules "default *": minimum track width 6mil, minimum drill 0.2mm, track to track 6mil, track to pad 6mil, pad to pad 6mil, via to via 6mil, smd to smd 6mil, copper to edge 0.3mm, drill to drill 6mil, minimum pad ring 10mil, minimum via ring 8mil, stop-mask expansion 4mil, vias tented up to drill 0mil, thermal gap 10mil
Holes 2.2 mm at 47,3 3,97 47,97 3,3 97,84 81,34 31,47.5

### Footprints (pad centres in the part's own frame; a part is rotated, then mirrored left to right if it is on the bottom)
1X02_LONGPADS = drill 1.118 pad 1.88 long: 1 0,0; 2 2.54,0
TACTILE-PTH = drill 1.016 pad 1.88: 1 -3.251,2.261; 2 3.251,2.261; 3 -3.251,-2.261; 4 3.251,-2.261
C1206 = smd 1.6 x 1.8: 1 -1.4,0; 2 1.4,0
1206 = smd 1.6 x 1.8: 1 -1.4,0; 2 1.4,0
1X04@1 = drill 1.016 pad 1.88 square: 1 0,0 | drill 1.016 pad 1.88: 2 2.54,0; 3 5.08,0; 4 7.62,0
1X06 = drill 1.016 pad 1.88: 1 0,0; 2 2.54,0; 3 5.08,0; 4 7.62,0; 5 10.16,0; 6 12.7,0
MINIMELF = smd 1.4 x 1.8: A 1.7,0; C -1.7,0
CHIPLED_1206 = smd 1.5 x 1.5: A 0,-1.75; C 0,1.75
1206' = smd 1.4 x 1.8: 1 -1.45,0; 2 1.45,0
SOT23 = smd 1 x 1.4: 1 -0.95,-1.1; 2 0.95,-1.1; 3 0,1.1
DBV_R-PDSO-G6 = smd 0.69 x 0.99: 1 -0.95,-1.29; 2 0,-1.29; 3 0.95,-1.29; 4 0.95,1.3; 5 0,1.3; 6 -0.95,1.3
SO08 = smd 0.61 x 2.21: 1 -1.905,-2.616; 2 -0.635,-2.616; 3 0.635,-2.616; 4 1.905,-2.616; 5 1.905,2.616; 6 0.635,2.616; 7 -0.635,2.616; 8 -1.905,2.616
USB-AB-MICRO-SMD_V03 = smd 1.4 x 0.4: D+1 2.7,0; D-1 2.7,0.65; GND1 2.7,-1.3; ID1 2.7,-0.65; VBUS1 2.7,1.3 | smd 1.5 x 1.8: SHIELD1 0,3.68; SHIELD3 0,-3.68 | smd 1.5 x 2.5: SHIELD2 0,0 | hole 0.85: 2.2,1.9; 2.2,-1.9
FRS1B = drill 0.914 long: 1 0,3.81; 2 0,-3.81; O -2.54,-3.81; P 10.16,3.81; P@ 10.16,-3.81; S -2.54,3.81
LED5MMRGB = drill 0.8 pad 1.676: 1 -2.159,0.968; 3 0.889,0.968; 4 2.159,-0.968 | drill 0.8 pad 1.676 octagon: 2 -0.635,-0.968
5110_LAYOUT = drill 0.8 long: CE 0,-5.08; CLK 0,2.54; DC 0,-2.54; DIN 0,0; GND 0,10.16; LIGHT 0,7.62; RST 0,-7.62; VCC 0,5.08
DIL04 = drill 0.813 offset: 1 -1.27,-3.81; 2 1.27,-3.81; 3 1.27,3.81; 4 -1.27,3.81
SOT23' = smd 0.9 x 1.2: 1 -0.95,-1.2; 2 0.95,-1.2; 3 0,1.2
TC26H = drill 0.813: 1 -1.27,0; 2 1.27,0
SSOT-6 = smd 0.7 x 1: 1 -0.95,-1.325; 2 0,-1.325; 3 0.95,-1.325; 4 0.95,1.325; 5 0,1.325; 6 -0.95,1.325
R1206 = smd 1.6 x 1.803: 1 -1.422,0; 2 1.422,0
TACTILE-SWITCH-SMD = smd 1.524 x 0.762: 1 -2.794,1.905; 2 2.794,1.905; 3 -2.794,-1.905; 4 2.794,-1.905
F/CM12P = drill 1.016 pad 2.54 octagon: + 3.81,0; - -3.81,0
2PT_GND_TIE = smd 1.27 x 0.635: P$1 0,0.635; P$2 0,-0.635
PS22_L02_DPDT_SW = drill 1.3: P$1 0,0; P$2 3.2,0; P$3 6.4,0; P$4 0,3; P$5 3.2,3; P$6 6.4,3; P$7 -2.6,-1.6; P$8 9,4.6
1X03 = drill 1.016 pad 1.88: 1 0,0; 2 2.54,0; 3 5.08,0
SOP8 = smd 0.76 x 1.27: 1 -1.905,-2.86; 2 -0.635,-2.86; 3 0.635,-2.86; 4 1.905,-2.86; 5 1.905,2.86; 6 0.635,2.86; 7 -0.635,2.86; 8 -1.905,2.86
SO016 = smd 0.6 x 1.2: 1 -4.445,-2.8; 2 -3.175,-2.8; 3 -1.905,-2.8; 4 -0.635,-2.8; 5 0.635,-2.8; 6 1.905,-2.8; 7 3.175,-2.8; 8 4.445,-2.8; 9 4.445,2.8; 10 3.175,2.8; 11 1.905,2.8; 12 0.635,2.8; 13 -0.635,2.8; 14 -1.905,2.8; 15 -3.175,2.8; 16 -4.445,2.8
SOT23-6L = smd 0.55 x 1.2: 1 -0.95,-1.3; 2 0,-1.3; 3 0.95,-1.3; 4 0.95,1.3; 5 0,1.3; 6 -0.95,1.3
SOT223 = smd 1.219 x 2.235: 1 -2.311,-3.099; 2 0,-3.099; 3 2.311,-3.099 | smd 3.6 x 2.2: 4 0,3.099
TQFP-48 = smd 1.5 x 0.28: 1 -4.25,2.75; 2 -4.25,2.25; 3 -4.25,1.75; 4 -4.25,1.25; 5 -4.25,0.75; 6 -4.25,0.25; 7 -4.25,-0.25; 8 -4.25,-0.75; 9 -4.25,-1.25; 10 -4.25,-1.75; 11 -4.25,-2.25; 12 -4.25,-2.75; 25 4.25,-2.75; 26 4.25,-2.25; 27 4.25,-1.75; 28 4.25,-1.25; 29 4.25,-0.75; 30 4.25,-0.25; 31 4.25,0.25; 32 4.25,0.75; 33 4.25,1.25; 34 4.25,1.75; 35 4.25,2.25; 36 4.25,2.75 | smd 0.28 x 1.5: 13 -2.75,-4.25; 14 -2.25,-4.25; 15 -1.75,-4.25; 16 -1.25,-4.25; 17 -0.75,-4.25; 18 -0.25,-4.25; 19 0.25,-4.25; 20 0.75,-4.25; 21 1.25,-4.25; 22 1.75,-4.25; 23 2.25,-4.25; 24 2.75,-4.25; 37 2.75,4.25; 38 2.25,4.25; 39 1.75,4.25; 40 1.25,4.25; 41 0.75,4.25; 42 0.25,4.25; 43 -0.25,4.25; 44 -0.75,4.25; 45 -1.25,4.25; 46 -1.75,4.25; 47 -2.25,4.25; 48 -2.75,4.25
BANANA_6MMHOLE = drill 6.02 pad 8.89: P$1 0,0
K3-2245_DPDT_SWITCH = drill 1: A0 0,5; A1 3.4,5; B0 0,0; B1 3.4,0; C0 0,2.5; C1 3.4,2.5

### Placement (x,y rotation side)
BATT  81.3,43 90 top
BTN1  58,95 270 top
BTN2  66,95 270 top
BTN3  74,95 270 top
BTN4  82,95 270 top
C1  11,78 90 top
C2  8,78 90 top
C3  30.04,71.51 270 top
C4  19,85 90 top
C5  31.79,84.04 0 top
C6  7,90 90 top
C7  41,91 180 top
C8  41.1,83.5 180 top
C9  40.93,94.85 180 top
C10  3,54 270 top
C11  7,41 90 top
C13  16,85 90 top
C14  73.91,88.96 180 top
C15  66.26,88.96 180 top
C16  57.61,88.96 180 top
C17  41.1,81.1 180 top
C18  34,94 0 top
C19  3.8,26 0 top
C20  3.8,17.4 180 top
C21  12,96 90 top
C22  9,96 90 top
C23  82,89 0 top
C24  88.4,56.6 180 top
C25  81,52.7 270 top
C26  28.6,94 0 top
C27  32.8,71.5 270 top
C28  81,76 270 top
C30  84.9,70.6 180 top
CLB  4,40 90 top
CLT  53,90 90 top
CRB  48,40 90 top
CRT  97,90 90 top
CT  36,31 180 top
D1  35,23 90 top
D2  98.5,41 0 top
D3  26,41 90 top
D4  98.5,46.7 0 top
D6  16,27 0 top
F1  [1206']  37,15 0 top
FB1  1.8u  [1206']  4.47,77.94 270 top
I2C  48,61.4 270 top
IC1  40,87 0 top
IC2  11,41 180 top
IC4  7.6,54.1 0 top
IC5  3.1,22.1 0 top
IC6  9.7,21.7 90 top
IC7  27.7,90.7 90 top
J1  88,85 270 top
J2  98,80 270 top
K2  32,22 180 bottom
LED1  4,32 180 top
M1  21.99,97.34 270 top
OK1  83,62 0 top
OK2  93.7,62 0 top
PWR  48,85.3 90 top
Q1  2N3904-MMBT  [SOT23']  39,23 0 top
Q2  11,85 0 top
Q3  86,38 0 top
Q4  2N3904-MMBT  [SOT23']  31,53 90 top
R1  95.7,41.1 270 top
R2  9.3,34.9 0 top
R3  20,41 270 top
R4  17,41 270 top
R5  31.3,57.2 180 top
R6  23,41 90 top
R7  25,21 180 top
R8  25,18 180 top
R9  25,24 0 top
R10  37,18 180 top
R11  38.4,71.5 270 top
R12  35.7,71.5 270 top
R13  82,39 90 top
R14  87,62.1 90 top
R15  92.9,70 0 top
R16  97,36 0 top
R17  34,88 180 top
R18  34,91 0 top
R19  89,34 0 top
R20  36,52 180 top
R21  89.5,62 270 top
R22  97.6,62 270 top
R34  42,34 270 top
R35  45,34 270 top
R36  48,34 270 top
R37  36.2,35.7 90 top
R38  33.2,35.7 90 top
R39  30.2,35.7 90 top
RST  3,90 90 top
SG1  22,53 0 top
SJ1  2,78 180 top
SW1  85.4,50.3 0 top
SWD  48,64 90 top
U1  89,44 270 top
U2  88,76 0 top
U3  91,38 0 top
U5  91.4,94.8 0 top
U$1  24.61,78.35 0 top
U$5  7,10 0 top
U$6  19,10 0 top
U$11  31,10 0 top
U$12  43,10 0 top
U$16  45.2,74.9 0 top

### Tracks (layer width: path | path; a pad name or v marks a point on that pad's centre or on a via)
1.25V  (via drill 0.35)
  Top 0.254: v9.4,69 9.4,69.8 15.2,75.6 U$1.12 | 9.45,39.1 IC2.4 | IC5.2 7.02,21 | 7.02,21 IC6.7 IC6.8 | IC6.8 7.08,19.28 C20.1 | IC6.8 7.5,19.8 12.15,15.15 | v9.5,22.3 8.2,21 7.02,21 | 9.45,39.1 9.6,38.95 v9.6,25.1 | 9.45,39.1 9.3,39.1 v8.8,39.6
  Top 1.27: R7.2 R8.2 15,18 12.15,15.15 U$5.P$1
  Bottom 0.254: v9.6,25.1 9.6,22.4 v9.5,22.3 | v9.4,69 9.4,58.7 8.2,57.5 8.2,40.2 v8.8,39.6
2.5V  (via drill 0.35, 0.4)
  Top 0.254: U$1.36 28.86,82.51 29.18,82.83 | U$1.24 28.55,72.91 C3.1 | U$1.48 21.86,83.44 21.15,84.15 v21.1,84.2 | 22.75,36.05 22.85,36.15 | C19.1 1.9,25.5 1.9,25.3 | 2.5,27.5 2.4,27.4
  Top 0.508: FB1.1 4.3,79.56 4.47,79.73 4.47,81.37 v5.1,82 | v28.4,83.7 29.18,82.92 29.18,82.83 C5.1 | 21.15,84.15 20.6,83.6 C4.1 18.5,83.6 v17.5,84.6 | 5.49,56.51 IC4.8 5.7,64.69 v6,65 | 5.49,56.51 4.38,55.4 C10.1 | v5.8,54.7 5.8,56.2 5.49,56.51 | v7.2,38.2 7,38.4 C11.1 8.4,41 10.3,41 11,40.3 IC2.5 11,38.1 12,37.1 | v4.7,69.5 1.7,72.5 v1.7,73.5 | v42.5,78.2 C17.1 | C3.1 C27.1 34.5,74.6 39.7,74.6 v43.3,71 | v13.4,37.1 12,37.1 | 22.75,36.05 13.05,36.05 12,37.1 | 22.85,36.15 D3.C | v12,31 14.3,28.7 D6.C 14.2,26.9 14.2,23.1 | v3.7,28.7 2.5,27.5 | 2.4,27.4 C19.1 | IC5.1 1.9,21.25 1.9,25.3 | 14.2,23.1 14.2,20.2 13.79,19.8 IC6.1 | IC6.3 13.44,22.34 14.2,23.1 | U$16.A1 45,83.5 v45,83.7
  Bottom 0.254: 27.9,84.2 28.05,84.05
  Bottom 0.508: v21.1,84.2 27.9,84.2 28.1,84.2 30.3,82 40,82 41.65,80.35 | 28.05,84.05 v28.4,83.7 | 41.65,80.35 43.3,78.7 43.3,78.1 | v43.3,71 43.3,78.1 | v42.5,78.2 42.6,78.1 43.3,78.1 | v5.8,54.7 6.9,54.7 7.2,54.4 v7.2,38.2 | v17.5,84.6 15.6,84.6 13,82 v5.1,82 5.1,76.9 v1.7,73.5 | v6,65 6,68.2 v4.7,69.5 | v13.4,37.1 15.6,34.9 15.6,32.8 13.8,31 v12,31 9.7,28.7 v3.7,28.7 | v45,83.7 41.65,80.35
2V5_STDBY  (via drill 0.35)
  Top 0.254: U$1.1 18.5,81.1 C13.1 15.4,83.6 v14.2,84.8 | IC1.2 40.95,86.75 v41.4,87.2
  Top 0.508: IC1.2 42.5,84.35 C8.1 43.5,83.5 46.6,80.4 46.6,78.8 48,77.4 U$16.C1
  Bottom 0.254: v41.4,87.2 38.1,90.5 19.9,90.5 v14.2,84.8
3V  (via drill 0.35)
  Top 0.508: IC7.2 28.8,92.4 C26.1 27.07,94.13 M1.VCC | D1.C 35,21.19 K2.1 29.81,16 25.9,16 25,16.9 25,26.8 21.7,30.1 21.7,31.8 | R12.1 R11.1 39.88,72.92 41.9,70.9 41.9,67.5 I2C.1 | v24.8,46.5 25.6,46.5 27.5,44.6 27.5,37.6 21.7,31.8 | v26.3,48.9 27.8,48.9 31,52.1 31,54.5 32.72,56.22 R5.1 33.02,56.9 v39,56.9 | v48.1,82.8 47.5,82.8 46.2,84.1 46.2,89.5 v44.3,91.4 | 21.7,31.8 18.6,34.9 R2.2
  Bottom 0.508: v24.8,46.5 26.3,48 v26.3,48.9 | v39,56.9 43.5,56.9 I2C.1 46.3,63.1 46.3,73.8 47,74.5 47,77.8 47.4,78.2 47.4,82.1 v48.1,82.8 | v44.3,91.4 40.9,91.4 38.5,93.8 28.8,93.8 27,95.6 27.07,95.67 M1.VCC
5V  (via drill 0.35)
  Top 0.254: C28.1 v81,79 | v90.7,80.5 90.7,80.8 89.25,82.25 J1.VBUS1 | 88,75 88,71 | 86.2,58.2 86.21,58.19 OK2.1 92.43,58 92.43,56 | U2.16 83.56,78.14 84.5,77.2 v86.1,77.2
  Top 0.508: v86.1,77.2 86.1,76.9 88,75 | 88,71 88,64.52 R14.2 86.88,63.4 v85.1,63.4 | v83.8,60.6 86.2,58.2 | 86.21,58.19 86.4,58 92.43,58 | OK2.1 92.43,56 92.3,56 90.2,53.9 90.2,51.9 SW1.P$2
  Bottom 0.254: v81,79 82.8,77.2 v86.1,77.2
  Bottom 0.508: v90.7,80.5 87.4,77.2 v86.1,77.2 | v85.1,63.4 85.1,61.9 v83.8,60.6
5V_ISO  (via drill 0.35)
  Top 0.254: SW1.P$1 87.05,51.95 87.05,54.15 87.9,55 88.2,55 C24.1 | R1.1 94.22,42.52 v94,42.3 | v93.2,47 92.11,45.91 U1.8
  Top 0.508: SW1.P$1 89.8,45.91 | 89.8,45.91 89.5,45.91 89.3,45.71 89.3,42.6 88.8,42.09 U1.4 | 89.8,45.91 U1.8
  Bottom 0.254: v94,42.3 93.2,43.1 v93.2,47
ADC_VBAT  (via drill 0.4)
  Top 0.254: U$1.18 24.36,75.36 v24.4,76.6 | v30.5,87.9 31.88,87.9 R17.2
  Top 0.508: C18.1 32.6,91.02 R18.1 R17.2
  Bottom 0.254: v24.4,76.6 20.1,80.9 20.1,84.4 23.6,87.9 v30.5,87.9
ADCI
  Top 0.254: IC4.1 4.81,50.6 2.1,50.6 1.3,51.4 1.3,64.2 13.7,76.6 U$1.10
  Top 0.508: IC4.1 IC4.2
ADCV
  Top 0.254: U$1.11 14.4,76.1 14.25,75.95 14,75.7 9.63,71.33 9.15,70.85 8.23,69.94 IC4.6
  Top 0.508: IC4.7 IC4.6
AGND  (via drill 0.35, 0.4)
  Top 0.254: U$1.8 13.8,77.6 12,79.4 C1.2 | C11.2 6.1,42.4 5.5,41.8 5.5,37.9 6.8,36.6 8.4,36.6 9.1,35.9 9.1,31.7 8.75,31.35 | 10.6,23 10.6,23.2 10.2,23.61 IC6.5 | 12,23.61 IC6.4 | C20.2 2.4,19.2 3.1,19.9 3.1,22.9 IC5.3
  Top 0.508: C1.2 C2.2 6.6,78 3.6,78 2.9,77.3 2.83,77.36 2.61,77.36 | IC2.2 11,44 | 11,44 11,44.3 10.3,45 7.6,45 7,44.4 C11.2 | 11,44 v12.1,45.1 | C10.2 3.9,53.5 8.6,53.5 9.51,52.59 IC4.4 9.51,53.01 10.5,54 10.5,57.4 v13.6,60.5 | v7.6,72.4 5.3,72.4 2,75.7 2,76.5 2.25,76.75 | 2.61,77.36 1.39,77.36 | 2.61,77.36 2.61,77.11 2.25,76.75 | SJ1.P$1 2.25,77.12 2.25,76.75 | IC6.2 11.04,21.07 10.6,21.5 10.6,23 9.99,23.61 IC6.5 | 10.6,23.2 11.01,23.61 12,23.61 | IC6.5 IC6.6 | 5.2,25.49 IC6.5 | 3.1,22.9 5.2,25 5.2,25.49 | 8.75,31.35 5.2,27.8 C19.2 5.2,25.49
  Bottom 0.508: v12.1,45.1 15.5,45.1 16.2,45.8 16.2,57.9 v13.6,60.5 12,62.1 12,70.3 9.9,72.4 v7.6,72.4
BTN1  (via drill 0.35)
  Top 0.254: CLB.1 2.2,41.8 2.2,48.5 2.9,49.2 10.8,49.2 11.3,49.7 11.3,56.2 16.8,61.7 16.8,67.3 v13.4,70.7 | v26.1,79.7 27,78.8 27,78.3 27.7,77.6 U$1.29
  Bottom 0.254: v13.4,70.7 15.9,73.2 24.5,73.2 26.1,74.8 v26.1,79.7
BTN1T  (via drill 0.35)
  Top 0.508: BTN1.1 58.6,96.59 58.6,90.8 59.01,90.39 C16.1 59.05,89 v60.7,89
  Bottom 0.508: CLT.1 54,89 v60.7,89
BTN2  (via drill 0.35)
  Top 0.254: v16.4,70.8 18.5,68.7 18.5,61.1 12.8,55.4 12.8,47.4 11.9,46.5 7.96,46.5 CLB.2 | v30.5,76.8 30.3,76.6 U$1.27
  Bottom 0.254: v16.4,70.8 17.4,71.8 24.6,71.8 29.6,76.8 v30.5,76.8
BTN2T  (via drill 0.35)
  Top 0.508: C15.1 66.5,90.12 66.5,93.5 | BTN2.1 66.5,96.49 66.5,93.5 | v65.2,93.5 66.5,93.5
  Bottom 0.508: CLT.2 54.14,92.54 55.1,93.5 v65.2,93.5
BTN3  (via drill 0.35)
  Top 0.254: v14.9,70.8 17.8,67.9 17.8,61.4 12.1,55.7 12.1,48.1 11.4,47.4 7.5,47.4 5.18,45.08 CLB.3 | v27,77.3 27.2,77.1 U$1.28
  Bottom 0.254: v14.9,70.8 16.6,72.5 24.5,72.5 27,75 v27,77.3
BTN3T  (via drill 0.35)
  Top 0.508: C14.1 74.5,89.77 74.5,94.7 | BTN3.1 74.5,96.49 74.5,94.7 | v73.6,94.8 74.4,94.8 74.5,94.7
  Bottom 0.508: CLT.3 73.32,95.08 v73.6,94.8
BTN4
  Top 0.254: CRB.1 45.7,42.3 45.7,56.7 38,64.4 26.3,64.4 24.86,65.84 U$1.19
BUZZ  (via drill 0.35)
  Top 0.254: U$1.33 34.8,79.6 v38.1,76.3 | R20.1 41.3,55.88 v41.3,58.2
  Bottom 0.254: v38.1,76.3 42.4,72 42.4,59.3 v41.3,58.2
GND  (via drill 0.35)
  Top 0.254: 22.6,81.2 22.36,81.44 U$1.47 22.36,85 20.96,86.4 C4.2 | 22.6,81.2 23.6,81.2 23.86,81.46 U$1.44 | C5.2 33.2,81.7 32.25,80.75 32.1,80.6 U$1.35 25.6,80.6 25.2,80.2 23.6,80.2 22.6,81.2 | RST.1 5.29,91.4 C6.2 | 37,89.42 v37,89 | 39.3,80.8 39.1,81 | v30.1,68.4 30.1,70.05 C3.2 29.11,70.11 29,70 26.86,72.14 U$1.23 26.86,75.64 25.7,76.8
  Top 0.508: RST.1 1.09,85.91 2,85 | C13.2 C4.2 | C22.2 8.2,97.4 | C3.2 31.4,70.1 | 32.25,80.75 33.95,80.75 v34,80.8 | Q1.2 39.95,20.05 v40,20 | M1.GND 31,96.19 31,95 C26.2 30.4,93.6 30.4,90.9 29.25,89.75 IC7.1 | SJ1.P$2 v2,80
  Bottom 0.508: 34.8,96.6 34.8,97.29 | 21,94.6 21,94.9
  other vias: 40,49 4,62 40.7,79.3 20,47 10.9,60.4 15,65
  pour Bottom (isolate 0.406): 0,100 50,100 50,0 0,0
  pour Top (isolate 0.406): 0,100 50,100 50,0 0,0
GND-ISO
  Top 0.254: J1.SHIELD1 J1.SHIELD2 J1.SHIELD3 84.32,81.62 84,81.3 | J1.GND1 86.7,81.6 86.4,81.3 85,81.3 84,81.3 | 84,81.3 83.3,81.3 | C28.2 82.7,76.3 82.8,76.4 83.56,75.64 83.56,73.3 U2.1 83.56,73 83.56,70.66 C30.2
  Top 0.508: 85,81.3 83.3,81.3 82.8,80.8 82.8,76.4 | 82.7,76.3 83.56,75.44 83.56,73.3 | 83.56,73.3 83.56,73 | 83.56,73.3 83.5,73.25 C30.2 83.5,66.58 OK1.3
  Bottom 0.508: OK1.3 83,64.54 83,52.8 84,51.8 87.1,51.8 SW1.P$5
GNDIO
  Top 0.254: 82.26,37.84 R13.1 85.58,34 R19.1 | 95.08,65.92 OK2.3 | SW1.P$4 85.4,55 C24.2
  Top 0.508: Q3.5 86,38.6 85.4,38 84,38 | 82.26,37.84 82.42,38 84,38 | J2.4 98,69 95.08,66.08 95.08,65.92 | C25.2 83.4,51.3 | 83.4,51.3 SW1.P$4 | 84,38 84,42 85.4,43.4 85.44,43.37 U1.3 87.73,43.37 87.8,43.3 88.3,43.8 88.3,45.3 87.69,45.91 U1.1 85,47.05 85,48.4 84.3,49.1 84.3,49.2 83.9,49.6 83.9,50.8 83.4,51.3
  Bottom 0.508: OK2.3 85.4,56.24 SW1.P$4
ISEL  (via drill 0.35)
  Top 0.254: v31.8,23.2 36,23.2 36.6,22.6 36.6,19.02 R10.2 | U$1.14 22.36,61.24 23,60.6 v23,48.3
  Bottom 0.254: v31.8,23.2 28.8,23.2 22,30 22,34.5 23,35.5 v23,48.3
LCD_CLK
  Top 0.254: U$1.39 26.36,88.4 24.53,90.23 M1.CLK
LCD_DC
  Top 0.254: U$1.45 23.36,89.34 19.4,93.3 19.45,93.35 M1.DC
LCD_DIN
  Top 0.254: U$1.41 25.36,83.96 25.8,84.4 25.8,87.9 25.45,88.25 25.3,88.4 21.99,91.71 M1.DIN
LCD_RST
  Top 0.254: U$1.46 22.86,88.85 M1.RST
LED1  (via drill 0.35)
  Top 0.254: U$1.5 16.7,79.1 v15.4,80.4
  Bottom 0.254: v15.4,80.4 10.4,80.4 1,71 1,35.4 1.7,34.7 5.3,34.7 6.16,33.84 LED1.1
LED2  (via drill 0.35)
  Top 0.254: U$1.6 15.6,78.6 v15,79.2 | LED1.3 3.11,35.89 v3,36
  Bottom 0.254: v15,79.2 11,79.2 2.3,70.5 2.3,36.7 v3,36
N$1
  Top 0.254: U$1.7 14.9,78.1 10.4,82.6 6.2,82.6 4.91,83.89 RST.3 6.3,88.6 C6.1
N$2
  Top 0.254: U$1.4 17.5,79.6 15.8,81.3 14.1,81.3 10.4,85 Q2.1
  Top 0.508: Q2.1 9.73,93.27 9,94 C22.1
N$3  (via drill 0.35)
  Top 0.254: R3.2 20,39.7 19.3,39.7 18,41 15,41 v14.9,40.9
  Top 0.508: v12.2,43.6 11.95,43.35 IC2.1
  Bottom 0.254: v12.2,43.6 v14.9,40.9
N$4  (via drill 0.35)
  Top 0.508: R4.2 v17,38 | v9,43 9.71,42.29 IC2.3
  Bottom 0.254: v17,38 14.8,38 9.8,43 v9,43
N$5  (via drill 0.35)
  Top 0.254: D3.A 23.28,42.7 R6.2
  Top 0.508: R6.2 R3.1 R4.1 17,45.4 v15.1,47.3 | v9.5,54.9 v9.51,54.91 IC4.5
  Bottom 0.508: v15.1,47.3 14.1,48.3 14.1,49.2 9.5,53.8 v9.5,54.9
N$6
  Top 0.508: Q1.1 38.05,18.37 R10.1
N$7
  Top 0.254: R9.2 26.42,25.82 28.6,28 34.4,28 36.5,25.9 42.07,25.9 K2.P@
  Top 0.508: F1.2 41.64,18.19 K2.P
  Top 1.27: K2.P K2.P@
N$8
  Top 0.254: U$1.9 11.5,77.1 C1.1
  Top 0.508: FB1.2 7.89,76.49 C2.1 C1.1
N$9  (via drill 0.35)
  Top 0.508: R6.1 23,39 21,37 v19,37
  Bottom 0.508: U$6.P$1 v19,37
N$10
  Top 1.27: R8.1 26.61,18.19 K2.S
N$11
  Top 0.508: K2.2 33.89,25.81 D1.A 38.5,24.7 Q1.3
N$12
  Top 1.27: R7.1 27.5,21 29.5,23 29.46,23.04 K2.O
N$13  (via drill 0.35)
  Top 0.254: D2.A 96.13,39.25 R1.2 96.92,40.9 v97.5,40.9 | v98,46.9 98.5,46.4 D4.A
  Bottom 0.254: v97.5,40.9 97.5,46.4 v98,46.9
N$14  (via drill 0.35)
  Top 0.508: BTN3.3 71.74,94.96 73.4,93.3 73.4,89.85 C14.2 71.04,88.96 v71,89 | C15.2 64.82,89 v63,89 | C16.2 57.5,90.25 57.5,96.49 BTN1.3 | v79,89 C23.1
  Bottom 0.508: CLT.4 55.11,97.62 BTN1.3 55.74,97.96 57.3,96.4 61.89,96.4 | BTN2.3 61.89,96.4 | 61.89,96.4 69.89,96.4 | 69.89,96.4 BTN3.3 | 69.89,96.4 77.89,96.4 BTN4.3 | v63,89 v71,89 v79,89
N$15  (via drill 0.35)
  Top 0.508: v91.4,90 U5.2
  Top 1.27: U5.2 U5.4
  Bottom 0.508: v91.4,90 94.46,90 CRT.2
  pour Top (no thermals): 95.1,97 87.5,97 87.5,99.1 95.1,99.1
N$16
  Top 0.254: R5.2 29.88,57.07 SG1.+
N$17
  Top 0.508: CRT.1 95.58,88.58 83.82,88.58 C23.2 82.5,89.9 82.5,96.49 BTN4.1
N$18  (via drill 0.35)
  Top 0.254: IC4.3 8.23,50.03 8,49.8 2.4,49.8 1.2,48.6 1.2,40 v5.2,36 | v14,33 20,27 | 20,27 23,24 R9.1 | D6.A 20,27
  Bottom 0.254: v5.2,36 11,36 v14,33
N$19
  Top 0.508: 96.08,95.08 CRT.3 93.08,95.08 93,95 93.94,94.06 93.94,92.04 | U5.3
  pour Top (no thermals): 94.8,90.7 92.6,90.7 92.6,96.1 94.8,96.1
N$20  (via drill 0.4)
  Top 0.508: v86.3,91.9 86.5,91.7 U5.1
  Bottom 0.508: CRT.4 92.28,91.9 v86.3,91.9
  pour Top (no thermals): 90.2,90.7 90.2,96.1 87.5,96.1 87.5,90.7
N$21
  Top 0.254: U$1.3 18.2,80.1 16.2,82.1 14.8,82.1 12.27,84.63 Q2.2
  Top 0.508: Q2.2 12.27,94.33 C21.1
N$22
  Top 0.508: U$11.P$1 35.55,14.55 F1.1
N$23
  Top 0.254: D2.C 96.75,44.5 94.5,44.5 93.36,43.37 U1.6
N$24
  Top 0.254: LED1.2 5.95,32.97 R2.1
N$25
  Top 0.254: U1.7 92.94,44.63 96.83,48.52 98.58,48.52 D4.C
N$26
  Top 0.254: R13.2 83.1,41.52 83.1,42 85.73,44.63 U1.2
N$27
  Top 0.254: U2.4 87.36,71.67 C30.1
N$28
  Top 0.254: R21.2 92.58,60.58 OK2.2
N$29  (via drill 0.35)
  Top 0.254: v90.4,67.5 90.4,68.92 R15.1
  Bottom 0.254: OK1.2 90.4,64.32 v90.4,67.5
N$30
  Top 0.254: U3.5 91,40 91.6,40.6 92.3,40.6 93.3,39.6 93.3,38.28 R16.1
N$31  (via drill 0.35)
  Top 0.254: Q3.2 86,37.2 86.6,37.8 | 88.4,37.8 89.1,37.8 90.05,38.75 U3.6
  Top 0.508: 86.6,37.8 88.4,37.8 v88.4,39.7
  Bottom 0.508: v88.4,39.7 82.56,45.54 BATT.2
N$32
  Top 0.254: Q3.6 85.05,39.95 85.5,40.4 86.6,40.4 87,40 86.95,39.95 Q3.4
N$33
  Top 0.254: Q3.3 86.97,36.7 U3.1
N$34
  Top 0.254: Q3.1 85.05,36.15 85.6,35.6 91.7,35.6 91.9,35.8 91.9,36.65 U3.3
N$35
  Top 0.254: R19.2 91.5,34 92.9,35.4 92.9,37.4 92.4,37.9 91.4,37.9 91,37.5 U3.2
N$36  (via drill 0.35)
  Top 0.254: v26.5,50.8 28.7,53 Q4.3
  Bottom 0.254: SG1.- 20.39,50.8 v26.5,50.8
N$37
  Top 0.254: Q4.1 32.25,52 R20.2
N$38  (via drill 0.35)
  Top 0.508: 42.4,92.4 C7.1 42.4,90.5 41.2,89.3 | 42.4,92.4 42.4,94.65 C9.1 | PWR.4 42.92,92.92 42.4,92.4 | IC1.3 41.2,89.3 | v45.1,85.4 41.2,89.3
  Bottom 0.508: v45.1,85.4 45.18,85.4 46.6,83.98 46.6,78.6 45.4,77.4 U$16.C0
RX  (via drill 0.35)
  Top 0.254: U$1.43 24.36,84.24 24.2,84.4 24.2,86.3 v24.8,86.9
  Bottom 0.254: v24.8,86.9 27.7,86.9 30,84.6 40.7,84.6 46.55,90.45 47.93,90.45 PWR.3
RX_IN  (via drill 0.35)
  Top 0.254: R14.1 85.42,60.68 81.7,64.4 81.73,64.43 OK1.4 | U2.3 v86.09,75.09 v86.1,75.1
  Bottom 0.254: v86.1,75.1 84.3,75.1 81.7,72.5 81.7,65.84 OK1.4
RX_OUT
  Top 0.254: J2.3 96.92,74.92 96.5,74.5 96.5,69.3 95.7,68.5 94.1,68.5 92.43,66.83 OK2.4 94.82,63.42 R22.1
SCL  (via drill 0.35)
  Top 0.254: U$1.21 25.86,70.74 27.5,69.1 27.5,67.5 28.6,66.4 34,66.4 | I2C.3 47.48,56.32 37.4,66.4 34,66.4 | v34.4,68.1 35.7,69.4 R12.2 | v33.9,65.5 33.9,66.3 34,66.4
  Bottom 0.254: v34.4,68.1 34.4,66 v33.9,65.5
SDA
  Top 0.254: U$1.22 26.36,71.24 28.3,69.3 28.3,68 29,67.3 38.3,67.3 38.4,67.2 | I2C.2 46.14,58.86 38.4,66.6 38.4,67.2 | R11.2 38.4,67.2
SWCLK
  Top 0.254: U$1.37 27.36,84 28.86,85.5 34.2,85.5 34.5,85.2 34.5,82.6 46.1,71 46.1,67.6 47.16,66.54 SWD.2
SWDIO
  Top 0.254: SWD.1 46.7,64 45.3,65.4 45.3,70.7 35.9,80.1 U$1.34
TP1A  (via drill 0.35)
  Top 0.254: U$1.15 22.86,62.84 23.8,61.9 23.8,49.68 28.38,45.1 28.38,34.98 | R34.2 39.52,32.58 37.82,34.28 | 37.82,34.28 R37.1 36.2,35.1 35.6,35.7 | v43.7,43.6 40.3,40.2 40.3,36.3 38.28,34.28 37.82,34.28
  Top 0.508: CT.6 CT.5 CT.4 28.38,34.98 29.1,35.7 35.6,35.7 | R37.1 36,34.08 CT.1
  Bottom 0.508: v43.7,43.6 46.94,43.6 CRB.2
TP1H  (via drill 0.35)
  Top 0.254: v36.2,38.3 R37.2 | v30.4,74.4 30.4,75.7 30,76.1 U$1.26
  Bottom 0.254: v36.2,38.3 32.9,41.6 32.9,62.2 28.6,66.5 28.6,72.6 v30.4,74.4
TP1L  (via drill 0.35)
  Top 0.254: v35.2,77.8 34.2,77.8 32.9,79.1 U$1.32 | v42,39.2 R34.1
  Bottom 0.254: v35.2,77.8 35.2,71.6 37,69.8 37,52 35.3,50.3 35.3,43.3 39.4,39.2 v42,39.2
TP2A  (via drill 0.35)
  Top 0.254: U$1.16 23.36,64.24 v24.3,63.3 | v37.5,32.5 39,31 43.42,31 R35.2 43.5,34.08 43.5,41.7 44.8,43 44.8,45.2 v44,46
  Top 0.508: R38.1 33.2,31.26 CT.2
  Bottom 0.254: v24.3,63.3 27.8,59.8 27.8,52.3 27.5,52 27.5,36.3 30.8,33 32.6,33 33.46,32.14 CT.2 34.96,32.5 v37.5,32.5 | CRB.3 44.92,45.08 v44,46
TP2H  (via drill 0.35)
  Top 0.254: R38.2 33.2,38 34.9,39.7 38.7,39.7 42.2,43.2 42.2,58.9 41.7,59.4 33.9,59.4 v32,61.3 | U$1.25 28.86,74.54 v28.9,74.5
  Bottom 0.254: v32,61.3 27.4,65.9 27.4,73 v28.9,74.5
TP2L  (via drill 0.35)
  Top 0.254: v32.7,78 32.1,78.6 U$1.31 | v45,38 R35.1
  Bottom 0.254: v32.7,78 32.7,73 36.2,69.5 36.2,52.7 34.5,51 34.5,42.7 39.2,38 v45,38
TP3A  (via drill 0.35)
  Top 0.254: v25,64.3 23.86,65.44 U$1.17 | v31.7,34.3 31.28,34.28 R39.1 | 38.62,29.2 32.7,29.2 30.92,30.98 | v45,40.2 46.5,38.7 46.5,33.2 47.4,32.3 48,32.3
  Top 0.508: R39.1 30.2,31.72 CT.3 30.92,30.98 | 44.8,29.1 44.8,11.8 U$12.P$1 | 38.62,29.2 38.72,29.1 44.8,29.1 | 44.8,29.1 48,32.3 R36.2
  Bottom 0.254: v25,64.3 28.7,60.6 28.7,52.2 28.3,51.8 28.3,37.29 v31.7,34.3 | v45,40.2 44.3,40.2 42.6,41.9 42.6,46 44.22,47.62 CRB.4
TP3H  (via drill 0.35)
  Top 0.254: U$1.20 25.36,70.24 26.2,69.4 26.2,66 v26.1,65.9 | v31.1,39.5 30.2,38.6 R39.2
  Bottom 0.254: v26.1,65.9 29.6,62.4 29.6,52 29.1,51.5 29.1,41.5 v31.1,39.5
TP3L  (via drill 0.35)
  Top 0.254: v31.2,77.8 30.9,78.1 U$1.30 | v48,37 R36.1
  Bottom 0.254: v31.2,77.8 31.2,73.4 35.3,69.3 35.3,53.2 33.8,51.7 33.8,42 38.8,37 v48,37
TX  (via drill 0.35)
  Top 0.254: v25,85.6 24.86,85.46 U$1.42
  Bottom 0.254: v25,85.6 27.9,85.6 29.7,83.8 42,83.8 46.1,87.9 47.94,87.9 PWR.2
TX_IN  (via drill 0.35)
  Top 0.254: U2.2 84.83,70 84.83,69.62 84.83,68.97 v85.9,67.9 | v89.3,66.5 89.3,63.62 R21.1
  Bottom 0.254: v85.9,67.9 87.3,66.5 v89.3,66.5
TX_OUT
  Top 0.254: R15.2 94.32,75.92 95.9,77.5 95.94,77.46 J2.2
UD+
  Top 0.254: J1.D+1 88,78.1 88.64,77.47 U2.5
UD-
  Top 0.254: J1.D-1 88.65,81.15 88.87,80.93 89,80.93 89.3,80.63 89.3,74.6 89.91,74 U2.6
V_BATT  (via drill 0.35)  (1 unrouted)
  Top 0.254: R16.2 98.42,36.48 97.1,37.8 95,37.8 94,38.8 94,39.95 U1.5 91.3,42.09 v90.5,41.3 | IC7.3 26.6,89.7 30.2,86.1 34.5,86.1 35.4,85.2 | U$16.A0 44.5,79.2 44.5,78.8 43,77.3 40.9,77.3 35.4,82.8 35.4,85.2 | R17.1 35.42,85.22 35.4,85.2 | R22.2 95.62,60.58 94.2,62 85.1,62 82.9,64.2 82.9,67.9 82.4,68.4 80.7,68.4 80.2,67.9 80.2,59.63 81.73,58.1
  Top 0.508: C25.1 81.73,54.83 81.73,58.1 OK1.1 | BATT.1 82.9,43 83.95,44.05 83.95,46.25 83.2,47 82,47 80.8,48.2 v80.8,48.3
  Bottom 0.254: BATT.1 82.3,43 87.5,37.8 89.7,37.8 89.8,37.7 90.5,38.4 v90.5,41.3
  Bottom 0.508: J2.1 96.7,80 92.9,76.2 82.6,76.2 80.2,73.8 80.2,59.72 OK1.1 80.8,57.26 v80.8,48.3
VSEL
  Top 0.254: IC2.6 13.8,41.55 13.8,55.2 19.4,60.8 19.4,71.64 U$1.13

### Text on the board
tPlace: 1 | VBAT | RX | 3 | 1 | 2 | TX | GND | VBAT | TX | RX | GND | GND | SWCLK | SWDIO | 3V | SDA | SCL | GND | - | + | 1 | 1 | 1 | 3 | 2 | 1 | STM32F1 DMM - embedblog.eu, 2019 v1.2B
bPlace: USB UART & CHRG INTERFACE / embedblog.eu, 2019
tNames: COM | VOLT | AMP | TEST